# EAGLE design bop_pcb (EAGLE 9.6.2)
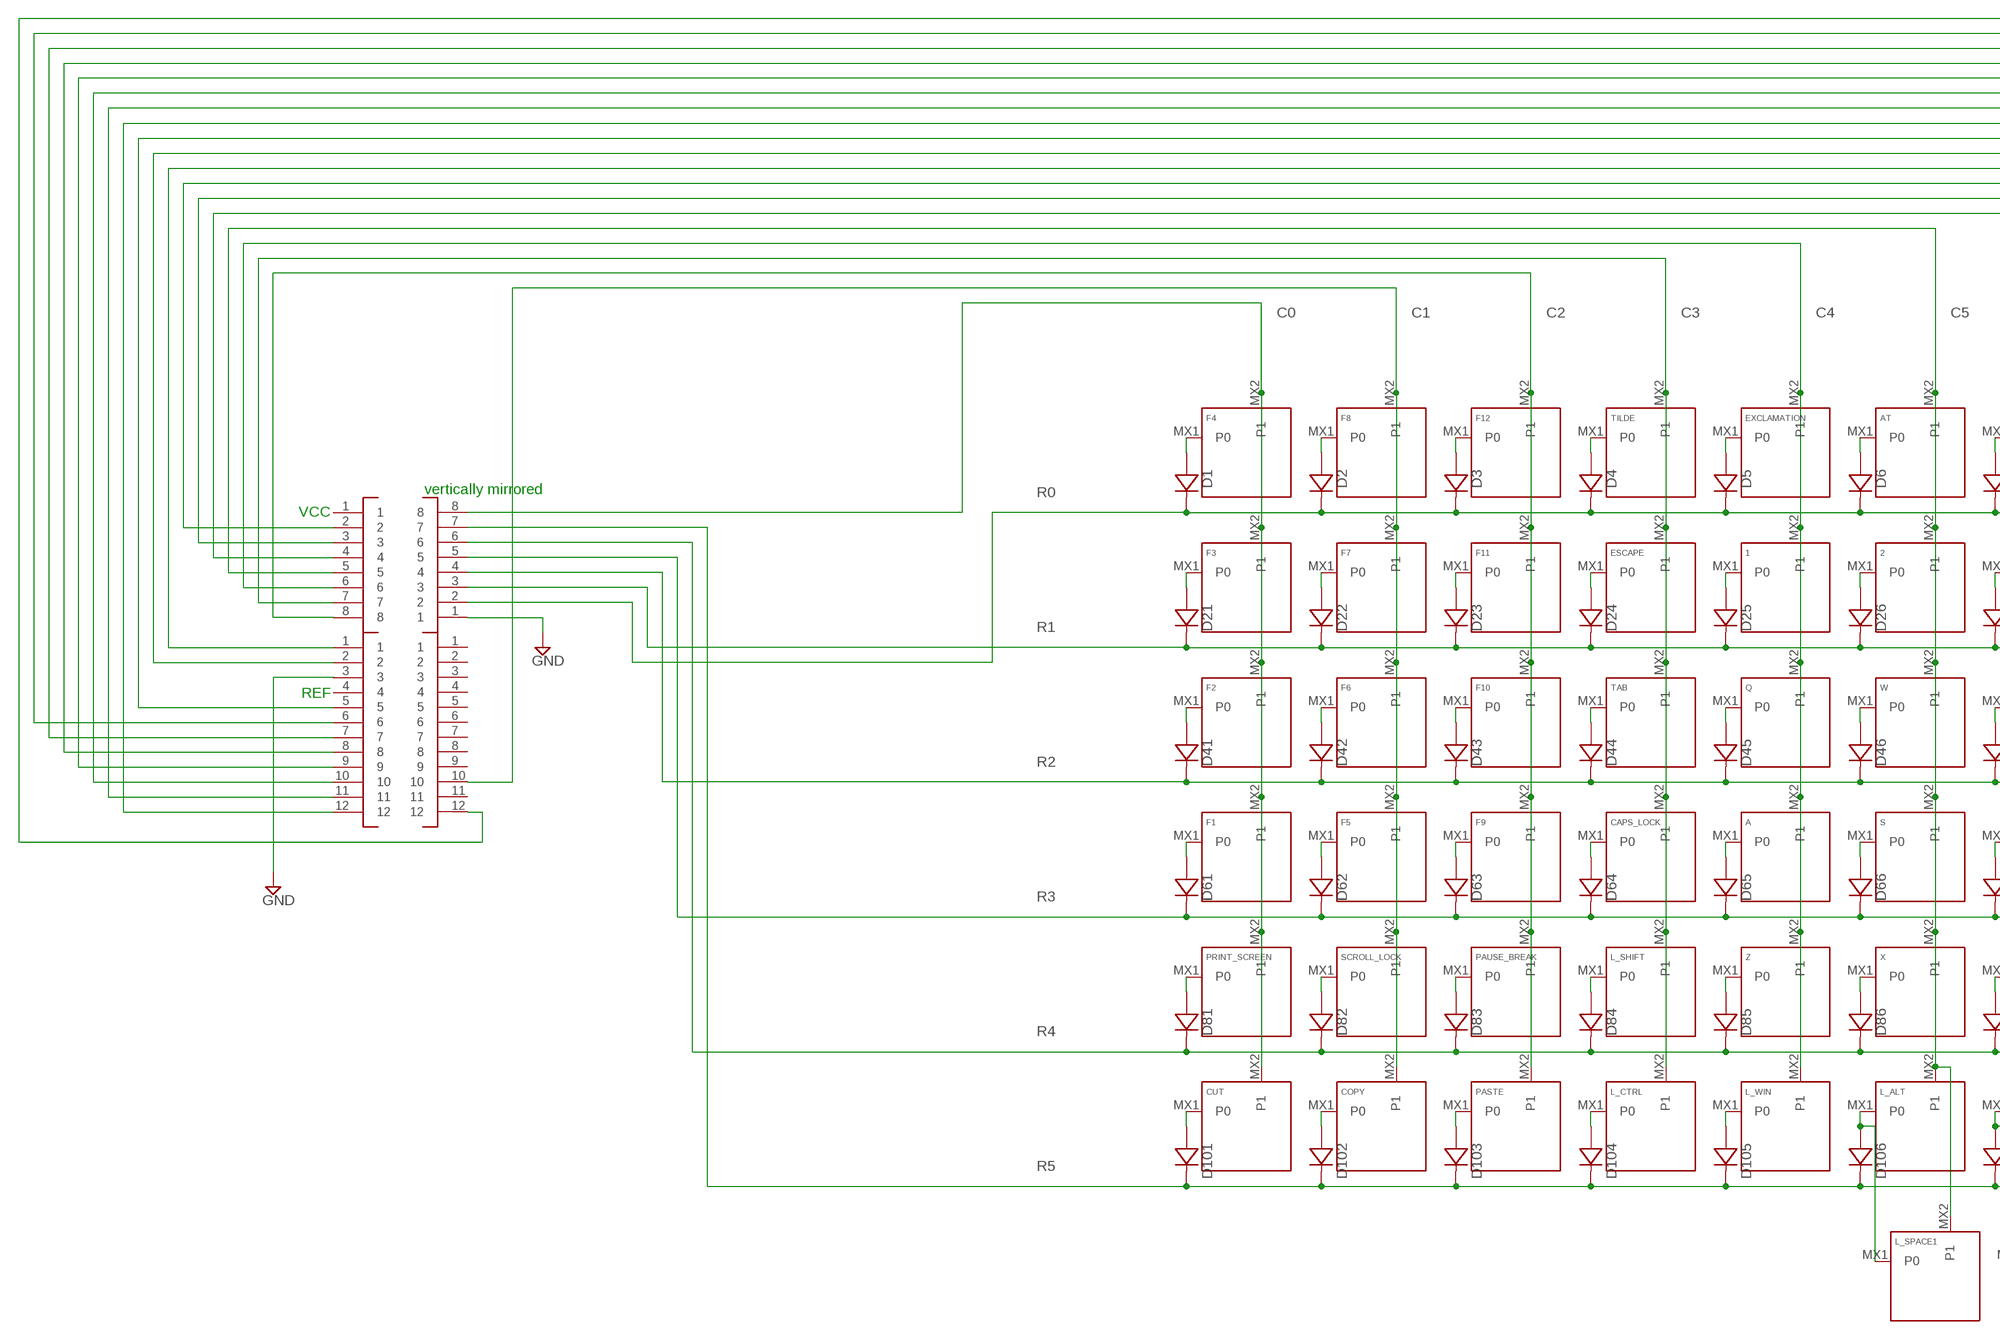
[diagram p0: schematic, sheet 1, part 1 of 2]
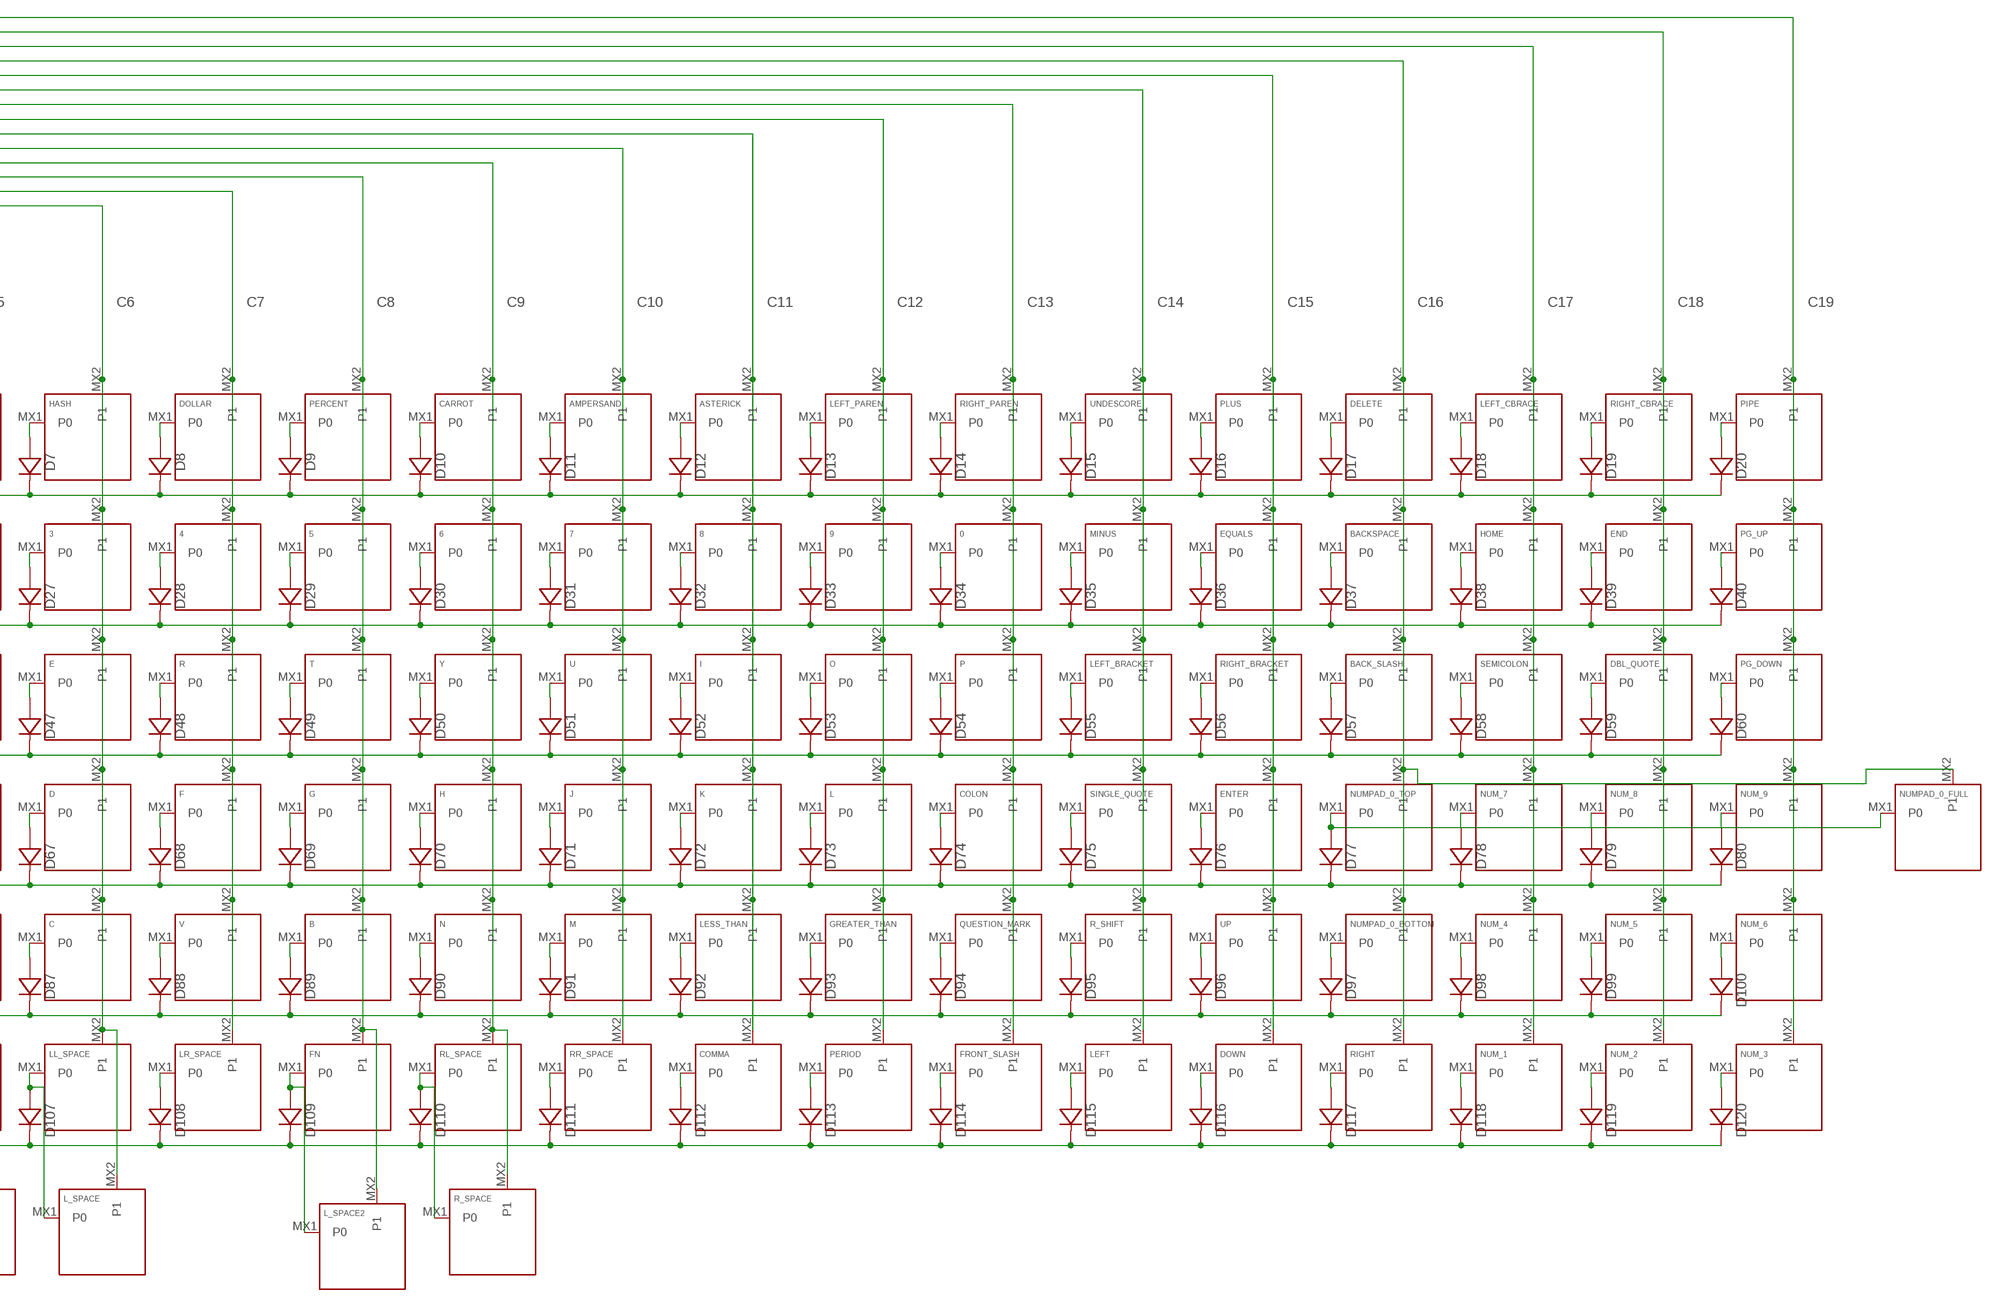
[diagram p1: schematic, sheet 1, part 2 of 2]

## Parts
0  KEYSWITCH-PLAIN-MX-1U  [MX-1U]
1  KEYSWITCH-PLAIN-MX-1U  [MX-1U]
2  KEYSWITCH-PLAIN-MX-1U  [MX-1U]
3  KEYSWITCH-PLAIN-MX-1U  [MX-1U]
4  KEYSWITCH-PLAIN-MX-1U  [MX-1U]
5  KEYSWITCH-PLAIN-MX-1U  [MX-1U]
6  KEYSWITCH-PLAIN-MX-1U  [MX-1U]
7  KEYSWITCH-PLAIN-MX-1U  [MX-1U]
8  KEYSWITCH-PLAIN-MX-1U  [MX-1U]
9  KEYSWITCH-PLAIN-MX-1U  [MX-1U]
A  KEYSWITCH-PLAIN-MX-1U  [MX-1U]
AMPERSAND  KEYSWITCH-PLAIN-MX-1U  [MX-1U]
ASTERICK  KEYSWITCH-PLAIN-MX-1U  [MX-1U]
AT  KEYSWITCH-PLAIN-MX-1U  [MX-1U]
B  KEYSWITCH-PLAIN-MX-1U  [MX-1U]
BACK_SLASH  KEYSWITCH-PLAIN-MX-1U  [MX-1U]
BACKSPACE  KEYSWITCH-PLAIN-MX-1U  [MX-1U]
C  KEYSWITCH-PLAIN-MX-1U  [MX-1U]
CAPS_LOCK  KEYSWITCH-PLAIN-MX-1U  [MX-1U]
CARROT  KEYSWITCH-PLAIN-MX-1U  [MX-1U]
COLON  KEYSWITCH-PLAIN-MX-1U  [MX-1U]
COMMA  KEYSWITCH-PLAIN-MX-1U  [MX-1U]
COPY  KEYSWITCH-PLAIN-MX-1U  [MX-1U]
CUT  KEYSWITCH-PLAIN-MX-1U  [MX-1U]
D  KEYSWITCH-PLAIN-MX-1U  [MX-1U]
D1  DIODE-SOD-123  [SOD-123]
D2  DIODE-SOD-123  [SOD-123]
D3  DIODE-SOD-123  [SOD-123]
D4  DIODE-SOD-123  [SOD-123]
D5  DIODE-SOD-123  [SOD-123]
D6  DIODE-SOD-123  [SOD-123]
D7  DIODE-SOD-123  [SOD-123]
D8  DIODE-SOD-123  [SOD-123]
D9  DIODE-SOD-123  [SOD-123]
D10  DIODE-SOD-123  [SOD-123]
D11  DIODE-SOD-123  [SOD-123]
D12  DIODE-SOD-123  [SOD-123]
D13  DIODE-SOD-123  [SOD-123]
D14  DIODE-SOD-123  [SOD-123]
D15  DIODE-SOD-123  [SOD-123]
D16  DIODE-SOD-123  [SOD-123]
D17  DIODE-SOD-123  [SOD-123]
D18  DIODE-SOD-123  [SOD-123]
D19  DIODE-SOD-123  [SOD-123]
D20  DIODE-SOD-123  [SOD-123]
D21  DIODE-SOD-123  [SOD-123]
D22  DIODE-SOD-123  [SOD-123]
D23  DIODE-SOD-123  [SOD-123]
D24  DIODE-SOD-123  [SOD-123]
D25  DIODE-SOD-123  [SOD-123]
D26  DIODE-SOD-123  [SOD-123]
D27  DIODE-SOD-123  [SOD-123]
D28  DIODE-SOD-123  [SOD-123]
D29  DIODE-SOD-123  [SOD-123]
D30  DIODE-SOD-123  [SOD-123]
D31  DIODE-SOD-123  [SOD-123]
D32  DIODE-SOD-123  [SOD-123]
D33  DIODE-SOD-123  [SOD-123]
D34  DIODE-SOD-123  [SOD-123]
D35  DIODE-SOD-123  [SOD-123]
D36  DIODE-SOD-123  [SOD-123]
D37  DIODE-SOD-123  [SOD-123]
D38  DIODE-SOD-123  [SOD-123]
D39  DIODE-SOD-123  [SOD-123]
D40  DIODE-SOD-123  [SOD-123]
D41  DIODE-SOD-123  [SOD-123]
D42  DIODE-SOD-123  [SOD-123]
D43  DIODE-SOD-123  [SOD-123]
D44  DIODE-SOD-123  [SOD-123]
D45  DIODE-SOD-123  [SOD-123]
D46  DIODE-SOD-123  [SOD-123]
D47  DIODE-SOD-123  [SOD-123]
D48  DIODE-SOD-123  [SOD-123]
D49  DIODE-SOD-123  [SOD-123]
D50  DIODE-SOD-123  [SOD-123]
D51  DIODE-SOD-123  [SOD-123]
D52  DIODE-SOD-123  [SOD-123]
D53  DIODE-SOD-123  [SOD-123]
D54  DIODE-SOD-123  [SOD-123]
D55  DIODE-SOD-123  [SOD-123]
D56  DIODE-SOD-123  [SOD-123]
D57  DIODE-SOD-123  [SOD-123]
D58  DIODE-SOD-123  [SOD-123]
D59  DIODE-SOD-123  [SOD-123]
D60  DIODE-SOD-123  [SOD-123]
D61  DIODE-SOD-123  [SOD-123]
D62  DIODE-SOD-123  [SOD-123]
D63  DIODE-SOD-123  [SOD-123]
D64  DIODE-SOD-123  [SOD-123]
D65  DIODE-SOD-123  [SOD-123]
D66  DIODE-SOD-123  [SOD-123]
D67  DIODE-SOD-123  [SOD-123]
D68  DIODE-SOD-123  [SOD-123]
D69  DIODE-SOD-123  [SOD-123]
D70  DIODE-SOD-123  [SOD-123]
D71  DIODE-SOD-123  [SOD-123]
D72  DIODE-SOD-123  [SOD-123]
D73  DIODE-SOD-123  [SOD-123]
D74  DIODE-SOD-123  [SOD-123]
D75  DIODE-SOD-123  [SOD-123]
D76  DIODE-SOD-123  [SOD-123]
D77  DIODE-SOD-123  [SOD-123]
D78  DIODE-SOD-123  [SOD-123]
D79  DIODE-SOD-123  [SOD-123]
D80  DIODE-SOD-123  [SOD-123]
D81  DIODE-SOD-123  [SOD-123]
D82  DIODE-SOD-123  [SOD-123]
D83  DIODE-SOD-123  [SOD-123]
D84  DIODE-SOD-123  [SOD-123]
D85  DIODE-SOD-123  [SOD-123]
D86  DIODE-SOD-123  [SOD-123]
D87  DIODE-SOD-123  [SOD-123]
D88  DIODE-SOD-123  [SOD-123]
D89  DIODE-SOD-123  [SOD-123]
D90  DIODE-SOD-123  [SOD-123]
D91  DIODE-SOD-123  [SOD-123]
D92  DIODE-SOD-123  [SOD-123]
D93  DIODE-SOD-123  [SOD-123]
D94  DIODE-SOD-123  [SOD-123]
D95  DIODE-SOD-123  [SOD-123]
D96  DIODE-SOD-123  [SOD-123]
D97  DIODE-SOD-123  [SOD-123]
D98  DIODE-SOD-123  [SOD-123]
D99  DIODE-SOD-123  [SOD-123]
D100  DIODE-SOD-123  [SOD-123]
D101  DIODE-SOD-123  [SOD-123]
D102  DIODE-SOD-123  [SOD-123]
D103  DIODE-SOD-123  [SOD-123]
D104  DIODE-SOD-123  [SOD-123]
D105  DIODE-SOD-123  [SOD-123]
D106  DIODE-SOD-123  [SOD-123]
D107  DIODE-SOD-123  [SOD-123]
D108  DIODE-SOD-123  [SOD-123]
D109  DIODE-SOD-123  [SOD-123]
D110  DIODE-SOD-123  [SOD-123]
D111  DIODE-SOD-123  [SOD-123]
D112  DIODE-SOD-123  [SOD-123]
D113  DIODE-SOD-123  [SOD-123]
D114  DIODE-SOD-123  [SOD-123]
D115  DIODE-SOD-123  [SOD-123]
D116  DIODE-SOD-123  [SOD-123]
D117  DIODE-SOD-123  [SOD-123]
D118  DIODE-SOD-123  [SOD-123]
D119  DIODE-SOD-123  [SOD-123]
D120  DIODE-SOD-123  [SOD-123]
DBL_QUOTE  KEYSWITCH-PLAIN-MX-1U  [MX-1U]
DELETE  KEYSWITCH-PLAIN-MX-1U  [MX-1U]
DOLLAR  KEYSWITCH-PLAIN-MX-1U  [MX-1U]
DOWN  KEYSWITCH-PLAIN-MX-1U  [MX-1U]
E  KEYSWITCH-PLAIN-MX-1U  [MX-1U]
END  KEYSWITCH-PLAIN-MX-1U  [MX-1U]
ENTER  KEYSWITCH-PLAIN-MX-1U  [MX-1U]
EQUALS  KEYSWITCH-PLAIN-MX-1U  [MX-1U]
ESCAPE  KEYSWITCH-PLAIN-MX-1U  [MX-1U]
EXCLAMATION  KEYSWITCH-PLAIN-MX-1U  [MX-1U]
F  KEYSWITCH-PLAIN-MX-1U  [MX-1U]
F1  KEYSWITCH-PLAIN-MX-1U  [MX-1U]
F2  KEYSWITCH-PLAIN-MX-1U  [MX-1U]
F3  KEYSWITCH-PLAIN-MX-1U  [MX-1U]
F4  KEYSWITCH-PLAIN-MX-1U  [MX-1U]
F5  KEYSWITCH-PLAIN-MX-1U  [MX-1U]
F6  KEYSWITCH-PLAIN-MX-1U  [MX-1U]
F7  KEYSWITCH-PLAIN-MX-1U  [MX-1U]
F8  KEYSWITCH-PLAIN-MX-1U  [MX-1U]
F9  KEYSWITCH-PLAIN-MX-1U  [MX-1U]
F10  KEYSWITCH-PLAIN-MX-1U  [MX-1U]
F11  KEYSWITCH-PLAIN-MX-1U  [MX-1U]
F12  KEYSWITCH-PLAIN-MX-1U  [MX-1U]
FN  KEYSWITCH-PLAIN-MX-1U  [MX-1U]
FRONT_SLASH  KEYSWITCH-PLAIN-MX-1U  [MX-1U]
G  KEYSWITCH-PLAIN-MX-1U  [MX-1U]
GREATER_THAN  KEYSWITCH-PLAIN-MX-1U  [MX-1U]
H  KEYSWITCH-PLAIN-MX-1U  [MX-1U]
HASH  KEYSWITCH-PLAIN-MX-1U  [MX-1U]
HOME  KEYSWITCH-PLAIN-MX-1U  [MX-1U]
I  KEYSWITCH-PLAIN-MX-1U  [MX-1U]
J  KEYSWITCH-PLAIN-MX-1U  [MX-1U]
J1  HEADER-12X1-2.54-ROUND  [HEADER-12X1-2.54-ROUND]
J2  HEADER-12X1-2.54-ROUND  [HEADER-12X1-2.54-ROUND]
K  KEYSWITCH-PLAIN-MX-1U  [MX-1U]
L  KEYSWITCH-PLAIN-MX-1U  [MX-1U]
L_ALT  KEYSWITCH-PLAIN-MX-1U  [MX-1U]
L_CTRL  KEYSWITCH-PLAIN-MX-1U  [MX-1U]
L_SHIFT  KEYSWITCH-PLAIN-MX-1U  [MX-1U]
L_SPACE  KEYSWITCH-PLAIN-MX-2U  [MX-2U]
L_SPACE1  KEYSWITCH-PLAIN-MX-2U  [MX-2U]
L_SPACE2  KEYSWITCH-PLAIN-MX-2U  [MX-2U]
L_WIN  KEYSWITCH-PLAIN-MX-1U  [MX-1U]
LEFT  KEYSWITCH-PLAIN-MX-1U  [MX-1U]
LEFT_BRACKET  KEYSWITCH-PLAIN-MX-1U  [MX-1U]
LEFT_CBRACE  KEYSWITCH-PLAIN-MX-1U  [MX-1U]
LEFT_PAREN  KEYSWITCH-PLAIN-MX-1U  [MX-1U]
LESS_THAN  KEYSWITCH-PLAIN-MX-1U  [MX-1U]
LL_SPACE  KEYSWITCH-PLAIN-MX-1U  [MX-1U]
LR_SPACE  KEYSWITCH-PLAIN-MX-1U  [MX-1U]
M  KEYSWITCH-PLAIN-MX-1U  [MX-1U]
MINUS  KEYSWITCH-PLAIN-MX-1U  [MX-1U]
N  KEYSWITCH-PLAIN-MX-1U  [MX-1U]
NUM_1  KEYSWITCH-PLAIN-MX-1U  [MX-1U]
NUM_2  KEYSWITCH-PLAIN-MX-1U  [MX-1U]
NUM_3  KEYSWITCH-PLAIN-MX-1U  [MX-1U]
NUM_4  KEYSWITCH-PLAIN-MX-1U  [MX-1U]
NUM_5  KEYSWITCH-PLAIN-MX-1U  [MX-1U]
NUM_6  KEYSWITCH-PLAIN-MX-1U  [MX-1U]
NUM_7  KEYSWITCH-PLAIN-MX-1U  [MX-1U]
NUM_8  KEYSWITCH-PLAIN-MX-1U  [MX-1U]
NUM_9  KEYSWITCH-PLAIN-MX-1U  [MX-1U]
NUMPAD_0_BOTTOM  KEYSWITCH-PLAIN-MX-1U  [MX-1U]
NUMPAD_0_FULL  KEYSWITCH-PLAIN-MX-2U  [MX-2U]
NUMPAD_0_TOP  KEYSWITCH-PLAIN-MX-1U  [MX-1U]
O  KEYSWITCH-PLAIN-MX-1U  [MX-1U]
P  KEYSWITCH-PLAIN-MX-1U  [MX-1U]
PASTE  KEYSWITCH-PLAIN-MX-1U  [MX-1U]
PAUSE_BREAK  KEYSWITCH-PLAIN-MX-1U  [MX-1U]
PERCENT  KEYSWITCH-PLAIN-MX-1U  [MX-1U]
PERIOD  KEYSWITCH-PLAIN-MX-1U  [MX-1U]
PG_DOWN  KEYSWITCH-PLAIN-MX-1U  [MX-1U]
PG_UP  KEYSWITCH-PLAIN-MX-1U  [MX-1U]
PIPE  KEYSWITCH-PLAIN-MX-1U  [MX-1U]
PLUS  KEYSWITCH-PLAIN-MX-1U  [MX-1U]
PRINT_SCREEN  KEYSWITCH-PLAIN-MX-1U  [MX-1U]
Q  KEYSWITCH-PLAIN-MX-1U  [MX-1U]
QUESTION_MARK  KEYSWITCH-PLAIN-MX-1U  [MX-1U]
R  KEYSWITCH-PLAIN-MX-1U  [MX-1U]
R_SHIFT  KEYSWITCH-PLAIN-MX-1U  [MX-1U]
R_SPACE  KEYSWITCH-PLAIN-MX-2U  [MX-2U]
RIGHT  KEYSWITCH-PLAIN-MX-1U  [MX-1U]
RIGHT_BRACKET  KEYSWITCH-PLAIN-MX-1U  [MX-1U]
RIGHT_CBRACE  KEYSWITCH-PLAIN-MX-1U  [MX-1U]
RIGHT_PAREN  KEYSWITCH-PLAIN-MX-1U  [MX-1U]
RL_SPACE  KEYSWITCH-PLAIN-MX-1U  [MX-1U]
RR_SPACE  KEYSWITCH-PLAIN-MX-1U  [MX-1U]
S  KEYSWITCH-PLAIN-MX-1U  [MX-1U]
SCROLL_LOCK  KEYSWITCH-PLAIN-MX-1U  [MX-1U]
SEMICOLON  KEYSWITCH-PLAIN-MX-1U  [MX-1U]
SINGLE_QUOTE  KEYSWITCH-PLAIN-MX-1U  [MX-1U]
T  KEYSWITCH-PLAIN-MX-1U  [MX-1U]
TAB  KEYSWITCH-PLAIN-MX-1U  [MX-1U]
TILDE  KEYSWITCH-PLAIN-MX-1U  [MX-1U]
U  KEYSWITCH-PLAIN-MX-1U  [MX-1U]
U$1  HEADER-8X1-2.54  [HEADER-8X1-2.54]
U$2  HEADER-8X1-2.54  [HEADER-8X1-2.54]
UNDESCORE  KEYSWITCH-PLAIN-MX-1U  [MX-1U]
UP  KEYSWITCH-PLAIN-MX-1U  [MX-1U]
V  KEYSWITCH-PLAIN-MX-1U  [MX-1U]
W  KEYSWITCH-PLAIN-MX-1U  [MX-1U]
X  KEYSWITCH-PLAIN-MX-1U  [MX-1U]
Y  KEYSWITCH-PLAIN-MX-1U  [MX-1U]
Z  KEYSWITCH-PLAIN-MX-1U  [MX-1U]

## Nets
C0: CUT.MX2(P1) F1.MX2(P1) F2.MX2(P1) F3.MX2(P1) F4.MX2(P1) PRINT_SCREEN.MX2(P1) U$2.8
C1: COPY.MX2(P1) F5.MX2(P1) F6.MX2(P1) F7.MX2(P1) F8.MX2(P1) J1.10 SCROLL_LOCK.MX2(P1)
C2: F9.MX2(P1) F10.MX2(P1) F11.MX2(P1) F12.MX2(P1) PASTE.MX2(P1) PAUSE_BREAK.MX2(P1) U$1.8
C3: CAPS_LOCK.MX2(P1) ESCAPE.MX2(P1) L_CTRL.MX2(P1) L_SHIFT.MX2(P1) TAB.MX2(P1) TILDE.MX2(P1) U$1.7
C4: 1.MX2(P1) A.MX2(P1) EXCLAMATION.MX2(P1) L_WIN.MX2(P1) Q.MX2(P1) U$1.6 Z.MX2(P1)
C5: 2.MX2(P1) AT.MX2(P1) L_ALT.MX2(P1) L_SPACE1.MX2(P1) S.MX2(P1) U$1.5 W.MX2(P1) X.MX2(P1)
C6: 3.MX2(P1) C.MX2(P1) D.MX2(P1) E.MX2(P1) HASH.MX2(P1) L_SPACE.MX2(P1) LL_SPACE.MX2(P1) U$1.4
C7: 4.MX2(P1) DOLLAR.MX2(P1) F.MX2(P1) LR_SPACE.MX2(P1) R.MX2(P1) U$1.3 V.MX2(P1)
C8: 5.MX2(P1) B.MX2(P1) FN.MX2(P1) G.MX2(P1) L_SPACE2.MX2(P1) PERCENT.MX2(P1) T.MX2(P1) U$1.2
C9: 6.MX2(P1) CARROT.MX2(P1) H.MX2(P1) J2.1 N.MX2(P1) R_SPACE.MX2(P1) RL_SPACE.MX2(P1) Y.MX2(P1)
C10: 7.MX2(P1) AMPERSAND.MX2(P1) J2.2 J.MX2(P1) M.MX2(P1) RR_SPACE.MX2(P1) U.MX2(P1)
C11: 8.MX2(P1) ASTERICK.MX2(P1) COMMA.MX2(P1) I.MX2(P1) J2.5 K.MX2(P1) LESS_THAN.MX2(P1)
C12: 9.MX2(P1) GREATER_THAN.MX2(P1) J2.12 L.MX2(P1) LEFT_PAREN.MX2(P1) O.MX2(P1) PERIOD.MX2(P1)
C13: 0.MX2(P1) COLON.MX2(P1) FRONT_SLASH.MX2(P1) J2.11 P.MX2(P1) QUESTION_MARK.MX2(P1) RIGHT_PAREN.MX2(P1)
C14: J2.10 LEFT.MX2(P1) LEFT_BRACKET.MX2(P1) MINUS.MX2(P1) R_SHIFT.MX2(P1) SINGLE_QUOTE.MX2(P1) UNDESCORE.MX2(P1)
C15: DOWN.MX2(P1) ENTER.MX2(P1) EQUALS.MX2(P1) J2.9 PLUS.MX2(P1) RIGHT_BRACKET.MX2(P1) UP.MX2(P1)
C16: BACK_SLASH.MX2(P1) BACKSPACE.MX2(P1) DELETE.MX2(P1) J2.8 NUMPAD_0_BOTTOM.MX2(P1) NUMPAD_0_FULL.MX2(P1) NUMPAD_0_TOP.MX2(P1) RIGHT.MX2(P1)
C17: HOME.MX2(P1) J2.7 LEFT_CBRACE.MX2(P1) NUM_1.MX2(P1) NUM_4.MX2(P1) NUM_7.MX2(P1) SEMICOLON.MX2(P1)
C18: DBL_QUOTE.MX2(P1) END.MX2(P1) J2.6 NUM_2.MX2(P1) NUM_5.MX2(P1) NUM_8.MX2(P1) RIGHT_CBRACE.MX2(P1)
C19: J1.12 NUM_3.MX2(P1) NUM_6.MX2(P1) NUM_9.MX2(P1) PG_DOWN.MX2(P1) PG_UP.MX2(P1) PIPE.MX2(P1)
GND: J2.3 U$2.1
N$1: D1.A F4.MX1(P0)
N$2: D2.A F8.MX1(P0)
N$3: D3.A F12.MX1(P0)
N$4: D4.A TILDE.MX1(P0)
N$5: D5.A EXCLAMATION.MX1(P0)
N$6: AT.MX1(P0) D6.A
N$7: D7.A HASH.MX1(P0)
N$8: D8.A DOLLAR.MX1(P0)
N$9: D9.A PERCENT.MX1(P0)
N$10: CARROT.MX1(P0) D10.A
N$11: AMPERSAND.MX1(P0) D11.A
N$12: ASTERICK.MX1(P0) D12.A
N$13: D13.A LEFT_PAREN.MX1(P0)
N$14: D14.A RIGHT_PAREN.MX1(P0)
N$15: D15.A UNDESCORE.MX1(P0)
N$16: D16.A PLUS.MX1(P0)
N$17: D17.A DELETE.MX1(P0)
N$18: D18.A LEFT_CBRACE.MX1(P0)
N$19: D19.A RIGHT_CBRACE.MX1(P0)
N$20: D20.A PIPE.MX1(P0)
N$21: D21.A F3.MX1(P0)
N$22: D22.A F7.MX1(P0)
N$23: D23.A F11.MX1(P0)
N$24: D24.A ESCAPE.MX1(P0)
N$25: 1.MX1(P0) D25.A
N$26: 2.MX1(P0) D26.A
N$27: 3.MX1(P0) D27.A
N$28: 4.MX1(P0) D28.A
N$29: 5.MX1(P0) D29.A
N$30: 6.MX1(P0) D30.A
N$31: 7.MX1(P0) D31.A
N$32: 8.MX1(P0) D32.A
N$33: 9.MX1(P0) D33.A
N$34: 0.MX1(P0) D34.A
N$35: D35.A MINUS.MX1(P0)
N$36: D36.A EQUALS.MX1(P0)
N$37: BACKSPACE.MX1(P0) D37.A
N$38: D38.A HOME.MX1(P0)
N$39: D39.A END.MX1(P0)
N$40: D40.A PG_UP.MX1(P0)
N$41: D41.A F2.MX1(P0)
N$42: D42.A F6.MX1(P0)
N$43: D43.A F10.MX1(P0)
N$44: D44.A TAB.MX1(P0)
N$45: D45.A Q.MX1(P0)
N$46: D46.A W.MX1(P0)
N$47: D47.A E.MX1(P0)
N$48: D48.A R.MX1(P0)
N$49: D49.A T.MX1(P0)
N$50: D50.A Y.MX1(P0)
N$51: D51.A U.MX1(P0)
N$52: D52.A I.MX1(P0)
N$53: D53.A O.MX1(P0)
N$54: D54.A P.MX1(P0)
N$55: D55.A LEFT_BRACKET.MX1(P0)
N$56: D56.A RIGHT_BRACKET.MX1(P0)
N$57: BACK_SLASH.MX1(P0) D57.A
N$58: D58.A SEMICOLON.MX1(P0)
N$59: D59.A DBL_QUOTE.MX1(P0)
N$60: D60.A PG_DOWN.MX1(P0)
N$61: D61.A F1.MX1(P0)
N$62: D62.A F5.MX1(P0)
N$63: D63.A F9.MX1(P0)
N$64: CAPS_LOCK.MX1(P0) D64.A
N$65: A.MX1(P0) D65.A
N$66: D66.A S.MX1(P0)
N$67: D67.A D.MX1(P0)
N$68: D68.A F.MX1(P0)
N$69: D69.A G.MX1(P0)
N$70: D70.A H.MX1(P0)
N$71: D71.A J.MX1(P0)
N$72: D72.A K.MX1(P0)
N$73: D73.A L.MX1(P0)
N$74: COLON.MX1(P0) D74.A
N$75: D75.A SINGLE_QUOTE.MX1(P0)
N$76: D76.A ENTER.MX1(P0)
N$77: D77.A NUMPAD_0_FULL.MX1(P0) NUMPAD_0_TOP.MX1(P0)
N$79: D79.A NUM_8.MX1(P0)
N$80: D80.A NUM_9.MX1(P0)
N$81: D81.A PRINT_SCREEN.MX1(P0)
N$82: D82.A SCROLL_LOCK.MX1(P0)
N$83: D83.A PAUSE_BREAK.MX1(P0)
N$84: D84.A L_SHIFT.MX1(P0)
N$85: D85.A Z.MX1(P0)
N$86: D86.A X.MX1(P0)
N$87: C.MX1(P0) D87.A
N$88: D88.A V.MX1(P0)
N$89: B.MX1(P0) D89.A
N$90: D90.A N.MX1(P0)
N$91: D91.A M.MX1(P0)
N$92: D92.A LESS_THAN.MX1(P0)
N$93: D93.A GREATER_THAN.MX1(P0)
N$94: D94.A QUESTION_MARK.MX1(P0)
N$95: D95.A R_SHIFT.MX1(P0)
N$96: D96.A UP.MX1(P0)
N$97: D97.A NUMPAD_0_BOTTOM.MX1(P0)
N$98: D98.A NUM_4.MX1(P0)
N$99: D99.A NUM_5.MX1(P0)
N$100: D100.A NUM_6.MX1(P0)
N$101: CUT.MX1(P0) D101.A
N$102: COPY.MX1(P0) D102.A
N$103: D103.A PASTE.MX1(P0)
N$104: D104.A L_CTRL.MX1(P0)
N$105: D105.A L_WIN.MX1(P0)
N$106: D106.A L_ALT.MX1(P0) L_SPACE1.MX1(P0)
N$107: D107.A L_SPACE.MX1(P0) LL_SPACE.MX1(P0)
N$108: D108.A LR_SPACE.MX1(P0)
N$109: D109.A FN.MX1(P0) L_SPACE2.MX1(P0)
N$110: D110.A R_SPACE.MX1(P0) RL_SPACE.MX1(P0)
N$111: D111.A RR_SPACE.MX1(P0)
N$112: COMMA.MX1(P0) D112.A
N$113: D113.A PERIOD.MX1(P0)
N$114: D114.A FRONT_SLASH.MX1(P0)
N$115: D115.A LEFT.MX1(P0)
N$116: D116.A DOWN.MX1(P0)
N$117: D117.A RIGHT.MX1(P0)
N$118: D118.A NUM_1.MX1(P0)
N$119: D119.A NUM_2.MX1(P0)
N$120: D120.A NUM_3.MX1(P0)
N$121: D78.A NUM_7.MX1(P0)
R0: D1.C D2.C D3.C D4.C D5.C D6.C D7.C D8.C D9.C D10.C D11.C D12.C D13.C D14.C D15.C D16.C D17.C D18.C D19.C D20.C U$2.2
R1: D21.C D22.C D23.C D24.C D25.C D26.C D27.C D28.C D29.C D30.C D31.C D32.C D33.C D34.C D35.C D36.C D37.C D38.C D39.C D40.C U$2.3
R2: D41.C D42.C D43.C D44.C D45.C D46.C D47.C D48.C D49.C D50.C D51.C D52.C D53.C D54.C D55.C D56.C D57.C D58.C D59.C D60.C U$2.4
R3: D61.C D62.C D63.C D64.C D65.C D66.C D67.C D68.C D69.C D70.C D71.C D72.C D73.C D74.C D75.C D76.C D77.C D78.C D79.C D80.C U$2.5
R4: D81.C D82.C D83.C D84.C D85.C D86.C D87.C D88.C D89.C D90.C D91.C D92.C D93.C D94.C D95.C D96.C D97.C D98.C D99.C D100.C U$2.6
R5: D101.C D102.C D103.C D104.C D105.C D106.C D107.C D108.C D109.C D110.C D111.C D112.C D113.C D114.C D115.C D116.C D117.C D118.C D119.C D120.C U$2.7
Unconnected: J1.1 J1.2 J1.3 J1.4 J1.5 J1.6 J1.7 J1.8 J1.9 J1.11 J2.4 U$1.1

## Notes on the sheet
- vertically mirrored
- VCC
- REF

## Library data of the parts
0 1-9 A AMPERSAND ASTERICK AT B BACK_SLASH BACKSPACE C CAPS_LOCK CARROT COLON COMMA COPY CUT D DBL_QUOTE DELETE DOLLAR DOWN E END ENTER EQUALS ESCAPE EXCLAMATION F F1-F12 FN FRONT_SLASH G GREATER_THAN H HASH HOME I J K L L_ALT L_CTRL L_SHIFT L_SPACE L_SPACE1 L_SPACE2 L_WIN LEFT LEFT_BRACKET LEFT_CBRACE LEFT_PAREN LESS_THAN LL_SPACE LR_SPACE M MINUS N NUM_1-NUM_9 NUMPAD_0_BOTTOM NUMPAD_0_FULL NUMPAD_0_TOP O P PASTE PAUSE_BREAK PERCENT PERIOD PG_DOWN PG_UP PIPE PLUS PRINT_SCREEN Q QUESTION_MARK R R_SHIFT R_SPACE RIGHT RIGHT_BRACKET RIGHT_CBRACE RIGHT_PAREN RL_SPACE RR_SPACE S SCROLL_LOCK SEMICOLON SINGLE_QUOTE T TAB TILDE U UNDESCORE UP V W X Y Z = Keyboard:KEYSWITCH-PLAIN
D1-D120 = Components:DIODE: Standard 1N4148 diode
J1 J2 = Controller:HEADER-12X1
U$1 U$2 = Controller:HEADER-8X1

## Board
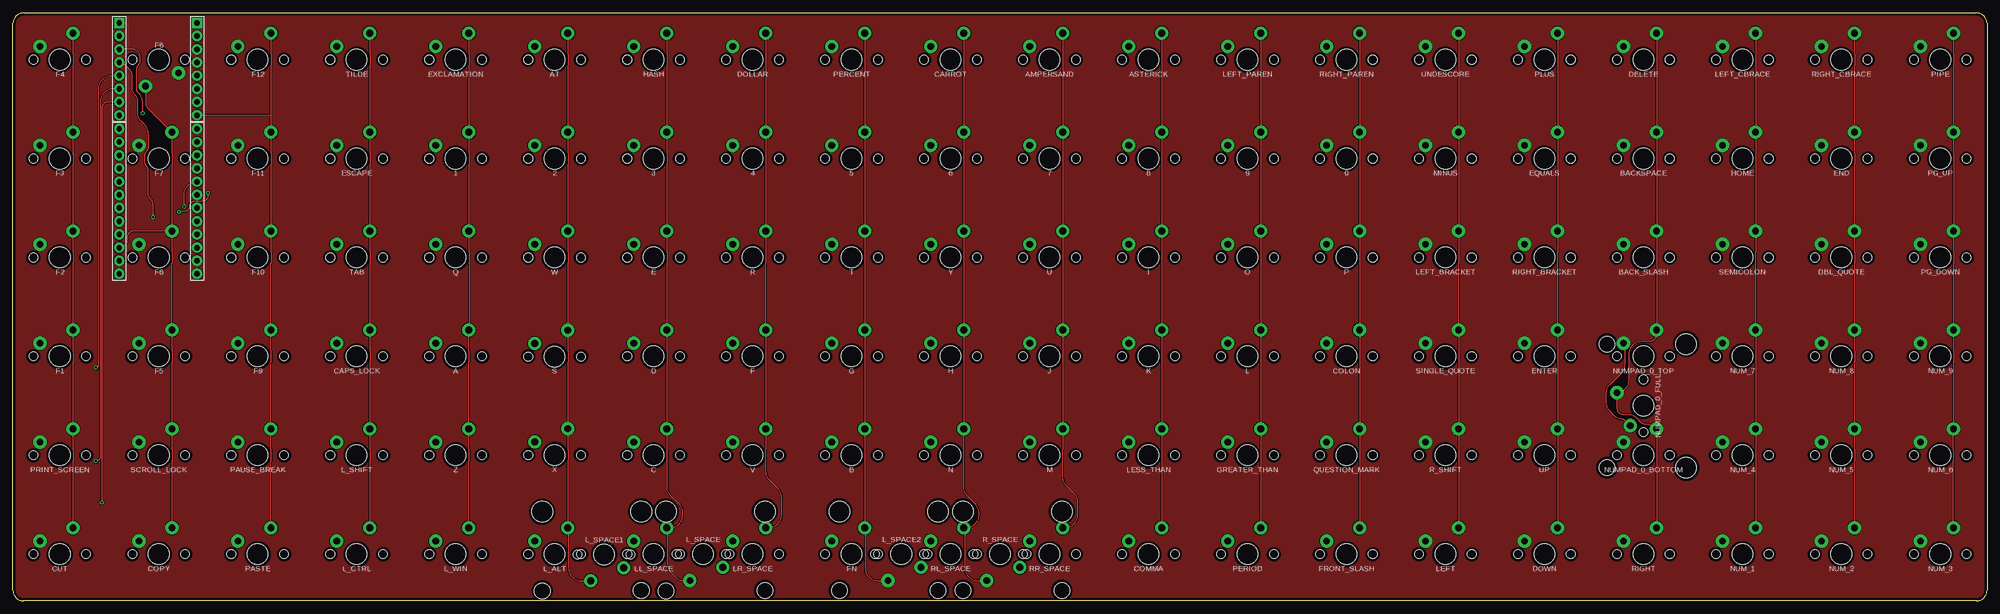
[diagram p2: board, top side]
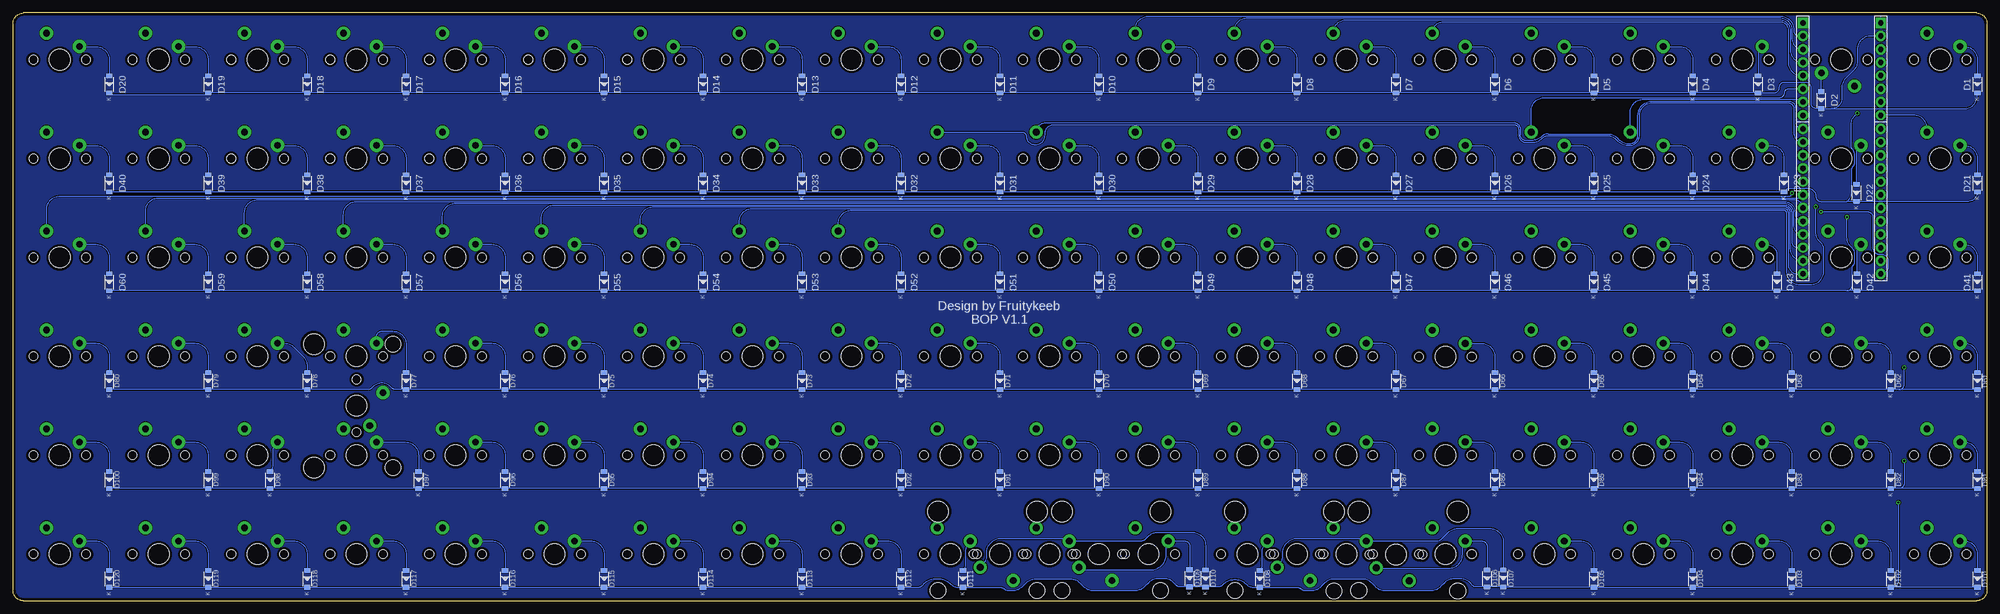
[diagram p3: board, bottom side, seen from below]

Size 379.95 x 113.25 mm. Coordinates in mm from the lower left corner, seen from the top.
Outline: 2,113.25 377.95,113.25 arc-90 379.95,111.25 379.95,2 arc-90 377.95,0 2,0 arc-90 0,2 0,111.25 arc-90 2,113.25
Copper layers (1*16): Top 0.035mm / dielectric 1.5mm / Bottom 0.035mm
Design rules "default *": minimum track width 6mil, minimum drill 0.35mm, track to track 6mil, track to pad 6mil, pad to pad 6mil, via to via 6mil, smd to smd 6mil, copper to edge 20mil, drill to drill 6mil, minimum pad ring 10mil, minimum via ring 8mil, stop-mask expansion 4mil, vias tented up to drill 0mil, thermal gap 10mil

### Footprints (pad centres in the part's own frame; a part is rotated, then mirrored left to right if it is on the bottom)
MX-1U = drill 1.3 pad 2.54: MX1 -3.81,2.54; MX2 2.54,5.08 | hole 4: 0,0 | hole 1.7: -5.08,0; 5.08,0
SOD-123 = smd 0.91 x 1.22: A -1.635,0; C 1.635,0
HEADER-12X1-2.54-ROUND = drill 1.05 pad 2: 1 -13.97,0; 2 -11.43,0; 3 -8.89,0; 4 -6.35,0; 5 -3.81,0; 6 -1.27,0; 7 1.27,0; 8 3.81,0; 9 6.35,0; 10 8.89,0; 11 11.43,0; 12 13.97,0
MX-2U = drill 1.3 pad 2.54: MX1 -3.81,2.54; MX2 2.54,5.08 | hole 4: 0,0; -11.9,-8.24; 11.9,-8.24 | hole 1.7: -5.08,0; 5.08,0 | hole 3.05: -11.9,7; 11.9,7
HEADER-8X1-2.54 = drill 1.05 pad 2 square: 1 -8.89,0 | drill 1.05 pad 2: 2 -6.35,0; 3 -3.81,0; 4 -1.27,0; 5 1.27,0; 6 3.81,0; 7 6.35,0; 8 8.89,0

### Placement (x,y rotation side)
0  256.65,85.2 0 top
1  85.2,85.2 0 top
2  104.25,85.2 0 top
3  123.3,85.2 0 top
4  142.35,85.2 0 top
5  161.4,85.2 0 top
6  180.45,85.2 0 top
7  199.5,85.2 0 top
8  218.55,85.2 0 top
9  237.6,85.2 0 top
A  85.2,47.1 0 top
AMPERSAND  199.5,104.25 0 top
ASTERICK  218.55,104.25 0 top
AT  104.25,104.25 0 top
B  161.4,28.05 0 top
BACK_SLASH  313.8,66.15 0 top
BACKSPACE  313.8,85.2 0 top
C  123.3,28.05 0 top
CAPS_LOCK  66.15,47.1 0 top
CARROT  180.45,104.25 0 top
COLON  256.65,47.1 0 top
COMMA  218.55,9 0 top
COPY  28.05,9 0 top
CUT  9,9 0 top
D  123.3,47.1 0 top
D1  1.86,99.49 270 bottom
D2  31.9,96.45 270 bottom
D3  44.08,99.49 270 bottom
D4  56.62,99.49 270 bottom
D5  75.67,99.49 270 bottom
D6  94.73,99.49 270 bottom
D7  113.78,99.49 270 bottom
D8  132.82,99.49 270 bottom
D9  151.88,99.49 270 bottom
D10  170.92,99.49 270 bottom
D11  189.97,99.49 270 bottom
D12  209.02,99.49 270 bottom
D13  228.07,99.49 270 bottom
D14  247.12,99.49 270 bottom
D15  266.18,99.49 270 bottom
D16  285.22,99.49 270 bottom
D17  304.27,99.49 270 bottom
D18  323.32,99.49 270 bottom
D19  342.38,99.49 270 bottom
D20  361.43,99.49 270 bottom
D21  1.86,80.44 270 bottom
D22  25.12,78.59 270 bottom
D23  39.08,80.44 270 bottom
D24  56.62,80.44 270 bottom
D25  75.67,80.44 270 bottom
D26  94.73,80.44 270 bottom
D27  113.78,80.44 270 bottom
D28  132.82,80.44 270 bottom
D29  151.88,80.44 270 bottom
D30  170.92,80.44 270 bottom
D31  189.97,80.44 270 bottom
D32  209.02,80.44 270 bottom
D33  228.07,80.44 270 bottom
D34  247.12,80.44 270 bottom
D35  266.18,80.44 270 bottom
D36  285.22,80.44 270 bottom
D37  304.27,80.44 270 bottom
D38  323.32,80.44 270 bottom
D39  342.38,80.44 270 bottom
D40  361.43,80.44 270 bottom
D41  1.86,61.39 270 bottom
D42  25.03,61.39 270 bottom
D43  40.44,61.39 270 bottom
D44  56.62,61.39 270 bottom
D45  75.67,61.39 270 bottom
D46  94.73,61.39 270 bottom
D47  113.78,61.39 270 bottom
D48  132.82,61.39 270 bottom
D49  151.88,61.39 270 bottom
D50  170.92,61.39 270 bottom
D51  189.97,61.39 270 bottom
D52  209.02,61.39 270 bottom
D53  228.07,61.39 270 bottom
D54  247.12,61.39 270 bottom
D55  266.18,61.39 270 bottom
D56  285.22,61.39 270 bottom
D57  304.27,61.39 270 bottom
D58  323.32,61.39 270 bottom
D59  342.38,61.39 270 bottom
D60  361.43,61.39 270 bottom
D61  1.86,42.34 270 bottom
D62  18.52,42.34 270 bottom
D63  37.58,42.34 270 bottom
D64  56.62,42.34 270 bottom
D65  75.67,42.34 270 bottom
D66  94.73,42.34 270 bottom
D67  113.78,42.34 270 bottom
D68  132.82,42.34 270 bottom
D69  151.88,42.34 270 bottom
D70  170.92,42.34 270 bottom
D71  189.97,42.34 270 bottom
D72  209.02,42.34 270 bottom
D73  228.07,42.34 270 bottom
D74  247.12,42.34 270 bottom
D75  266.18,42.34 270 bottom
D76  285.22,42.34 270 bottom
D77  304.27,42.34 270 bottom
D78  323.32,42.34 270 bottom
D79  342.38,42.34 270 bottom
D80  361.43,42.34 270 bottom
D81  1.86,23.29 270 bottom
D82  18.52,23.29 270 bottom
D83  37.58,23.29 270 bottom
D84  56.62,23.29 270 bottom
D85  75.67,23.29 270 bottom
D86  94.73,23.29 270 bottom
D87  113.78,23.29 270 bottom
D88  132.82,23.29 270 bottom
D89  151.88,23.29 270 bottom
D90  170.92,23.29 270 bottom
D91  189.97,23.29 270 bottom
D92  209.02,23.29 270 bottom
D93  228.07,23.29 270 bottom
D94  247.12,23.29 270 bottom
D95  266.18,23.29 270 bottom
D96  285.22,23.29 270 bottom
D97  301.89,23.29 270 bottom
D98  330.47,23.29 270 bottom
D99  342.38,23.29 270 bottom
D100  361.43,23.29 270 bottom
D101  1.86,4.24 270 bottom
D102  18.52,4.24 270 bottom
D103  37.58,4.24 270 bottom
D104  56.62,4.24 270 bottom
D105  75.67,4.24 270 bottom
D106  96.22,4.31 270 bottom
D107  93.12,4.31 270 bottom
D108  139.97,4.24 270 bottom
D109  153.48,4.34 270 bottom
D110  150.42,4.3 270 bottom
D111  197.12,4.24 270 bottom
D112  209.02,4.24 270 bottom
D113  228.07,4.24 270 bottom
D114  247.12,4.24 270 bottom
D115  266.18,4.24 270 bottom
D116  285.22,4.24 270 bottom
D117  304.27,4.24 270 bottom
D118  323.32,4.24 270 bottom
D119  342.38,4.24 270 bottom
D120  361.43,4.24 270 bottom
DBL_QUOTE  351.9,66.15 0 top
DELETE  313.8,104.25 0 top
DOLLAR  142.35,104.25 0 top
DOWN  294.75,9 0 top
E  123.3,66.15 0 top
END  351.9,85.2 0 top
ENTER  294.75,47.1 0 top
EQUALS  294.75,85.2 0 top
ESCAPE  66.15,85.2 0 top
EXCLAMATION  85.2,104.25 0 top
F  142.35,47.1 0 top
F1  9,47.1 0 top
F2  9,66.15 0 top
F3  9,85.2 0 top
F4  9,104.25 0 top
F5  28.05,47.1 0 top
F6  28.05,66.15 0 top
F7  28.05,85.2 0 top
F8  28.05,104.25 180 top
F9  47.1,47.1 0 top
F10  47.1,66.15 0 top
F11  47.1,85.2 0 top
F12  47.1,104.25 0 top
FN  161.4,9 0 top
FRONT_SLASH  256.65,9 0 top
G  161.4,47.1 0 top
GREATER_THAN  237.6,28.05 0 top
H  180.45,47.1 0 top
HASH  123.3,104.25 0 top
HOME  332.85,85.2 0 top
I  218.55,66.15 0 top
J  199.5,47.1 0 top
J1  20.45,76.95 270 top
J2  35.45,76.95 270 top
K  218.55,47.1 0 top
L  237.6,47.1 0 top
L_ALT  104.25,9 0 top
L_CTRL  66.15,9 0 top
L_SHIFT  66.15,28.05 0 top
L_SPACE  132.82,9 180 top
L_SPACE1  113.77,8.93 180 top
L_SPACE2  170.97,9 180 top
L_WIN  85.2,9 0 top
LEFT  275.7,9 0 top
LEFT_BRACKET  275.7,66.15 0 top
LEFT_CBRACE  332.85,104.25 0 top
LEFT_PAREN  237.6,104.25 0 top
LESS_THAN  218.55,28.05 0 top
LL_SPACE  123.3,9 0 top
LR_SPACE  142.35,9 0 top
M  199.5,28.05 0 top
MINUS  275.7,85.2 0 top
N  180.45,28.05 0 top
NUM_1  332.85,9 0 top
NUM_2  351.9,9 0 top
NUM_3  370.95,9 0 top
NUM_4  332.85,28.05 0 top
NUM_5  351.9,28.05 0 top
NUM_6  370.95,28.05 0 top
NUM_7  332.85,47.1 0 top
NUM_8  351.9,47.1 0 top
NUM_9  370.95,47.1 0 top
NUMPAD_0_BOTTOM  313.8,28.05 0 top
NUMPAD_0_FULL  313.8,37.57 90 top
NUMPAD_0_TOP  313.8,47.1 0 top
O  237.6,66.15 0 top
P  256.65,66.15 0 top
PASTE  47.1,9 0 top
PAUSE_BREAK  47.1,28.05 0 top
PERCENT  161.4,104.25 0 top
PERIOD  237.6,9 0 top
PG_DOWN  370.95,66.15 0 top
PG_UP  370.95,85.2 0 top
PIPE  370.95,104.25 0 top
PLUS  294.75,104.25 0 top
PRINT_SCREEN  9,28.05 0 top
Q  85.2,66.15 0 top
QUESTION_MARK  256.65,28.05 0 top
R  142.35,66.15 0 top
R_SHIFT  275.7,28.05 0 top
R_SPACE  189.97,9 180 top
RIGHT  313.8,9 0 top
RIGHT_BRACKET  294.75,66.15 0 top
RIGHT_CBRACE  351.9,104.25 0 top
RIGHT_PAREN  256.65,104.25 0 top
RL_SPACE  180.45,9 0 top
RR_SPACE  199.5,9 0 top
S  104.25,47.05 0 top
SCROLL_LOCK  28.05,28.05 0 top
SEMICOLON  332.85,66.15 0 top
SINGLE_QUOTE  275.7,47.1 0 top
T  161.4,66.15 0 top
TAB  66.15,66.15 0 top
TILDE  66.15,104.25 0 top
U  199.5,66.15 0 top
U$1  35.45,102.45 270 top
U$2  20.45,102.45 270 top
UNDESCORE  275.7,104.25 0 top
UP  294.75,28.05 0 top
V  142.35,28.05 0 top
W  104.25,66.15 0 top
X  104.25,28.1 0 top
Y  180.45,66.15 0 top
Z  85.2,28.05 0 top

### Tracks (layer width: path | path; a pad name or v marks a point on that pad's centre or on a via)
C0
  Top 0.152: F4.MX2 11.54,105.36 11.58,105.32 11.58,103.18 11.54,103.13 F3.MX2 | F3.MX2 11.54,85.95 | F3.MX2 11.54,86.31 11.58,86.27 11.58,84.13 11.54,84.08 F2.MX2 11.54,67.26 11.58,67.22 11.58,65.08 11.54,65.03 F1.MX2 11.54,48.21 11.58,48.17 11.58,46.03 11.54,45.98 PRINT_SCREEN.MX2 11.54,29.16 11.58,29.12 11.58,26.98 11.54,26.93 CUT.MX2
  Bottom 0.152: F3.MX2 11.54,91.02 arc-90 14.08,93.56 U$2.8
C1
  Top 0.152: F6.MX2 30.59,84.08 30.63,84.13 30.63,86.27 30.59,86.31 F7.MX2 arc45 30.57,90.33 25.95,94.95 arc-45 25.51,96.01 F8.MX2 | F6.MX2 30.59,67.26 30.63,67.22 30.63,65.08 30.59,65.03 F5.MX2 30.59,48.21 30.63,48.17 30.63,46.03 30.59,45.98 SCROLL_LOCK.MX2 30.59,29.16 30.63,29.12 30.63,26.98 30.59,26.93 COPY.MX2 | F6.MX2 23.23,71.23 arc90 21.95,69.95 21.95,69.56 arc-90 J1.10
C2
  Top 0.152: F12.MX2 49.64,105.36 49.68,105.32 49.68,103.18 49.64,103.13 49.64,93.45 | 49.64,93.45 F11.MX2 49.64,86.31 49.68,86.27 49.68,84.13 49.64,84.08 F10.MX2 49.64,67.26 49.68,67.22 49.68,65.08 49.64,65.03 F9.MX2 49.64,48.21 49.68,48.17 49.68,46.03 49.64,45.98 PAUSE_BREAK.MX2 49.64,29.16 49.68,29.12 49.68,26.98 49.64,26.93 PASTE.MX2 | U$1.8 49.53,93.56 49.64,93.45
C3
  Top 0.152: TILDE.MX2 68.69,105.36 68.73,105.32 68.73,103.18 68.69,103.13 ESCAPE.MX2 68.69,86.31 68.73,86.27 68.73,84.13 68.69,84.08 TAB.MX2 68.69,67.26 68.73,67.22 68.73,65.08 68.69,65.03 CAPS_LOCK.MX2 68.69,48.21 68.73,48.17 68.73,46.03 68.69,45.98 L_SHIFT.MX2 68.69,29.16 68.73,29.12 68.73,26.98 68.69,26.93 L_CTRL.MX2
  Bottom 0.152: ESCAPE.MX2 68.69,94.08 arc90 66.15,96.62 35.97,96.62 arc90 U$1.7
C4
  Top 0.152: EXCLAMATION.MX2 87.74,105.36 87.78,105.32 87.78,103.18 87.74,103.13 1.MX2 87.74,86.31 87.78,86.27 87.78,84.13 87.74,84.08 Q.MX2 87.74,67.26 87.78,67.22 87.78,65.08 | 87.74,65.03 87.78,65.08 | L_WIN.MX2 87.74,26.93 87.78,26.98 87.78,29.12 87.74,29.16 Z.MX2 87.74,45.98 87.78,46.03 87.78,48.17 87.74,48.21 87.74,51.95 | 87.74,51.95 A.MX2 | 87.78,65.08 87.78,51.99 87.74,51.95
  Bottom 0.152: 1.MX2 87.74,94.41 arc90 85.2,96.95 39.95,96.95 arc-90 38.95,97.95 arc90 38.26,98.64 U$1.6
C5
  Top 0.152: AT.MX2 106.79,105.36 106.83,105.32 106.83,103.18 106.79,103.13 2.MX2 106.79,86.31 106.83,86.27 106.83,84.13 106.79,84.08 W.MX2 106.79,67.26 106.83,67.22 106.83,65.08 106.79,65.03 S.MX2 106.79,48.16 106.83,48.12 106.83,45.98 106.79,45.93 X.MX2 106.79,29.21 106.83,29.17 106.83,27.03 106.79,26.98 L_ALT.MX2 106.92,13.95 106.92,6.39 arc90 109.46,3.85 L_SPACE1.MX2
  Bottom 0.152: AT.MX2 arc90 104.52,111.6 39.91,111.6 arc90 38.25,109.94 38.25,103.72 arc-90 35.71,101.18 U$1.5
C6
  Top 0.152: HASH.MX2 125.84,105.36 125.88,105.32 125.88,103.18 125.84,103.13 3.MX2 125.84,86.31 125.88,86.27 125.88,84.13 125.84,84.08 E.MX2 125.84,67.26 125.88,67.22 125.88,65.08 125.85,65.05 125.85,52.19 D.MX2 125.84,48.21 125.88,48.17 125.88,46.03 125.84,45.98 C.MX2 125.84,29.16 125.88,29.12 125.88,22.07 arc45 126.63,20.27 128.24,18.66 arc-45 128.95,16.95 128.95,16.62 arc-90 126.41,14.08 LL_SPACE.MX2 arc-45 125.95,13.81 125.95,7.2 arc45 126.69,5.4 127.43,4.66 arc45 129.23,3.92 L_SPACE.MX2
  Bottom 0.152: HASH.MX2 125.84,109.41 arc90 123.3,111.95 39.95,111.95 arc90 37.89,109.89 37.89,106.16 arc-90 U$1.4
C7
  Top 0.152: DOLLAR.MX2 144.89,105.36 144.93,105.32 144.93,103.18 144.89,103.13 4.MX2 144.89,86.31 144.93,86.27 144.93,84.13 144.89,84.08 R.MX2 144.89,67.26 144.93,67.22 144.93,65.08 144.89,65.03 F.MX2 144.89,48.21 144.93,48.17 144.93,46.03 144.89,45.98 V.MX2 144.89,29.16 144.93,29.12 144.93,24.98 arc45 145.68,23.18 147.21,21.66 arc-45 147.95,19.86 147.95,16.62 arc-90 145.41,14.08 LR_SPACE.MX2
  Bottom 0.152: DOLLAR.MX2 144.89,109.77 arc90 142.35,112.31 39.87,112.31 arc90 37.56,110 37.56,108.37 arc-90 U$1.3
C8
  Top 0.152: PERCENT.MX2 163.94,105.36 163.98,105.32 163.98,103.18 163.94,103.13 5.MX2 163.94,86.31 163.98,86.27 163.98,84.13 163.94,84.08 T.MX2 163.94,67.26 163.98,67.22 163.98,65.08 163.94,65.03 G.MX2 163.94,48.21 163.98,48.17 163.98,46.03 163.94,45.98 B.MX2 163.94,29.16 163.98,29.12 163.98,26.98 163.94,26.93 FN.MX2 164.01,14.01 164.01,6.34 arc90 166.43,3.92 L_SPACE2.MX2
  Bottom 0.152: PERCENT.MX2 163.94,110.11 arc90 161.4,112.65 39.77,112.65 arc90 37.23,110.11 37.23,109.91 arc-90 36.12,108.8 U$1.2
C9
  Top 0.152: CARROT.MX2 182.99,105.36 183.03,105.32 183.03,103.18 182.99,103.13 6.MX2 182.99,86.31 183.03,86.27 183.03,84.13 182.99,84.08 Y.MX2 182.99,67.26 183.03,67.22 183.03,65.08 182.99,65.03 H.MX2 182.99,48.21 183.03,48.17 183.03,46.03 182.99,45.98 N.MX2 182.99,29.16 183.03,29.12 183.03,26.98 182.99,26.93 182.99,21.96 arc45 183.73,20.16 185.24,18.66 arc-45 185.95,16.95 185.95,16.62 arc-90 183.41,14.08 RL_SPACE.MX2 182.99,13.37 arc90 183.15,13.2 arc-90 183.2,13.16 183.2,6.46 arc90 185.74,3.92 R_SPACE.MX2
  Bottom 0.152: 6.MX2 arc90 181.16,92.11 91.05,92.11 arc90 89.87,90.93 89.87,89.81 arc-90 88.73,88.68 87.55,88.68 arc-45 85.75,89.42 85.75,89.43 arc45 84.48,89.95 73,89.95 arc45 71.21,89.2 70.95,88.95 arc-45 68.83,88.07 arc-90 67.18,89.72 67.18,93.48 arc90 64.35,96.3 38.26,96.3 arc90 36.85,94.9 36.85,92.32 arc-90 J2.1
C10
  Top 0.152: AMPERSAND.MX2 202.04,105.36 202.08,105.32 202.08,103.18 202.04,103.13 7.MX2 202.04,86.31 202.08,86.27 202.08,84.13 202.04,84.08 U.MX2 202.04,67.26 202.08,67.22 202.08,65.08 202.04,65.03 J.MX2 202.04,48.21 202.08,48.17 202.08,46.03 202.04,45.98 M.MX2 202.04,29.16 202.08,29.12 202.08,23.92 arc45 202.83,22.13 204.21,20.75 arc-45 204.95,18.95 204.95,16.62 arc-90 202.41,14.08 RR_SPACE.MX2
  Bottom 0.152: 7.MX2 185.66,90.28 arc90 184.94,89.55 arc-90 183.3,87.92 183.08,87.92 arc-90 181.31,89.69 181.31,89.96 arc90 179.49,91.78 91.08,91.78 arc90 90.18,90.88 90.18,89.78 arc-90 88.75,88.35 87.42,88.35 arc-45 85.63,89.09 85.59,89.13 arc45 84.36,89.64 73.02,89.64 arc45 71.53,89.02 71.28,88.77 arc-45 68.85,87.77 68.8,87.77 arc-90 66.87,89.7 66.87,93.48 arc90 64.35,96 38.41,96 arc90 37.16,94.75 37.16,90.09 arc-90 J2.2
C11  (via drill 0.35)
  Top 0.152: ASTERICK.MX2 221.09,105.36 221.13,105.32 221.13,103.18 221.09,103.13 8.MX2 221.09,86.31 221.13,86.27 221.13,84.13 221.09,84.08 I.MX2 221.09,67.26 221.13,67.22 221.13,65.08 221.09,65.03 K.MX2 221.09,48.21 221.13,48.17 221.13,46.03 221.09,45.98 LESS_THAN.MX2 221.09,29.16 221.13,29.12 221.13,26.98 221.09,26.93 COMMA.MX2 | v32.95,75.95 32.95,78.26 arc-90 J2.5
  Bottom 0.152: I.MX2 221.09,72.73 arc90 218.55,75.27 39.13,75.27 arc90 38.62,74.76 38.62,63.49 arc-90 36.08,60.95 33.94,60.95 arc-90 31.4,63.49 31.4,67.63 arc-45 31.95,68.95 32.21,69.2 arc45 32.95,71 v32.95,75.95
C12
  Top 0.152: LEFT_PAREN.MX2 240.14,105.36 240.18,105.32 240.18,103.18 240.14,103.13 9.MX2 240.14,86.31 240.18,86.27 240.18,84.13 240.14,84.08 O.MX2 240.14,67.26 240.18,67.22 240.18,65.08 240.14,65.03 L.MX2 240.14,48.21 240.18,48.17 240.18,46.03 240.14,45.98 GREATER_THAN.MX2 240.14,29.16 240.18,29.12 240.18,26.98 240.14,26.93 PERIOD.MX2
  Bottom 0.152: O.MX2 240.14,73.07 arc90 237.6,75.61 39.03,75.61 arc90 38.29,74.87 38.29,64.86 arc-90 36.41,62.98 J2.12
C13
  Top 0.152: RIGHT_PAREN.MX2 259.19,105.36 259.23,105.32 259.23,103.18 259.19,103.13 0.MX2 259.19,86.31 259.23,86.27 259.23,84.13 259.19,84.08 P.MX2 259.19,67.26 259.23,67.22 259.23,65.08 259.19,65.03 COLON.MX2 259.19,48.21 259.23,48.17 259.23,46.03 259.19,45.98 QUESTION_MARK.MX2 259.19,29.16 259.23,29.12 259.23,26.98 259.19,26.93 FRONT_SLASH.MX2
  Bottom 0.152: P.MX2 259.19,73.41 arc90 256.65,75.95 39.03,75.95 arc90 37.95,74.87 37.95,68.02 arc-90 J2.11
C14
  Top 0.152: UNDESCORE.MX2 278.24,105.36 278.28,105.32 278.28,103.18 278.24,103.13 MINUS.MX2 278.24,86.31 278.28,86.27 278.28,84.13 278.24,84.08 LEFT_BRACKET.MX2 278.24,67.26 278.28,67.22 278.28,65.08 278.24,65.03 SINGLE_QUOTE.MX2 278.24,48.21 278.28,48.17 278.28,46.03 278.24,45.98 R_SHIFT.MX2 278.24,29.16 278.28,29.12 278.28,26.98 278.24,26.93 LEFT.MX2
  Bottom 0.152: LEFT_BRACKET.MX2 278.24,73.74 arc90 275.7,76.28 39.06,76.28 arc90 37.62,74.83 37.62,69.26 arc-90 36.41,68.06 J2.10
C15
  Top 0.152: PLUS.MX2 297.29,105.36 297.33,105.32 297.33,103.18 297.29,103.13 EQUALS.MX2 297.29,86.31 297.33,86.27 297.33,84.13 297.29,84.08 RIGHT_BRACKET.MX2 297.29,67.26 297.33,67.22 297.33,65.08 297.29,65.03 ENTER.MX2 297.29,48.21 297.33,48.17 297.33,46.03 297.29,45.98 UP.MX2 297.29,29.16 297.33,29.12 297.33,26.98 297.29,26.93 DOWN.MX2
  Bottom 0.152: RIGHT_BRACKET.MX2 297.29,74.08 arc90 294.75,76.62 39.04,76.62 arc90 37.3,74.88 37.3,72.45 arc-90 J2.9
C16
  Top 0.152: DELETE.MX2 316.34,105.36 316.38,105.32 316.38,103.18 316.34,103.13 BACKSPACE.MX2 316.34,86.31 316.38,86.27 316.38,84.13 316.34,84.08 BACK_SLASH.MX2 316.34,67.26 316.38,67.22 316.38,65.08 316.34,65.03 NUMPAD_0_TOP.MX2 316.34,51.34 arc-90 314.95,49.95 313.49,49.95 arc90 310.95,47.41 310.95,42.34 arc-90 NUMPAD_0_FULL.MX2 308.72,37.18 arc90 309.95,35.95 310.95,35.95 arc-45 312.39,35.35 313.32,34.42 arc45 314.16,34.07 314.34,34.07 arc-45 316.14,33.33 NUMPAD_0_BOTTOM.MX2 316.34,29.16 316.38,29.12 316.38,26.98 316.34,26.93 RIGHT.MX2
  Bottom 0.152: BACK_SLASH.MX2 316.34,74.41 arc90 313.8,76.95 39.07,76.95 arc90 36.95,74.83 36.95,74.64 arc-90 J2.8
C17
  Top 0.152: LEFT_CBRACE.MX2 335.39,105.36 335.43,105.32 335.43,103.18 335.39,103.13 HOME.MX2 335.39,86.31 335.43,86.27 335.43,84.13 335.39,84.08 SEMICOLON.MX2 335.39,67.26 335.43,67.22 335.43,65.08 335.39,65.03 NUM_7.MX2 335.39,48.21 335.43,48.17 335.43,46.03 335.39,45.98 NUM_4.MX2 335.39,29.16 335.43,29.12 335.43,26.98 335.39,26.93 NUM_1.MX2
  Bottom 0.152: SEMICOLON.MX2 335.39,74.74 arc90 332.85,77.28 37.05,77.28 arc90 J2.7
C18
  Top 0.152: RIGHT_CBRACE.MX2 354.44,105.36 354.48,105.32 354.48,103.18 354.44,103.13 END.MX2 354.44,86.31 354.48,86.27 354.48,84.13 354.44,84.08 DBL_QUOTE.MX2 354.44,67.26 354.48,67.22 354.48,65.08 354.44,65.03 NUM_8.MX2 354.44,48.21 354.48,48.17 354.48,46.03 354.44,45.98 NUM_5.MX2 354.44,29.16 354.48,29.12 354.48,26.98 354.44,26.93 NUM_2.MX2
  Bottom 0.152: DBL_QUOTE.MX2 354.44,75.09 arc90 351.9,77.63 36.04,77.63 arc-90 J2.6
C19  (via drill 0.35)
  Top 0.152: PIPE.MX2 373.49,105.36 373.53,105.32 373.53,103.18 373.49,103.13 PG_UP.MX2 373.49,86.31 373.53,86.27 373.53,71.86 373.95,71.45 373.73,71.23 PG_DOWN.MX2 373.49,67.26 373.53,67.22 373.53,65.08 373.49,65.03 NUM_9.MX2 373.49,48.21 373.53,48.17 373.53,46.03 373.49,45.98 NUM_6.MX2 373.49,29.16 373.53,29.12 373.53,26.98 373.49,26.93 NUM_3.MX2 | v37.53,78.53 37.53,78.09 arc-90 36.4,76.96 34.91,76.96 arc90 33.92,75.98 arc-90 32.89,74.95 v31.95,74.95
  Bottom 0.152: PG_DOWN.MX2 373.49,75.41 arc90 370.95,77.95 38.12,77.95 arc-90 v37.53,78.53 | v31.95,74.95 22.95,74.95 arc90 21.95,73.95 21.95,67.95 arc-90 20.79,66.79 20.31,66.79 arc90 18.99,65.46 18.99,64.44 arc90 J1.12
GND
  pour Bottom: -0.05,111.45 -0.05,112.45 0.45,112.95 0.95,113.45 1.45,113.45 378.95,113.45 379.45,112.95 379.95,112.45 379.95,110.95 379.95,0.95 379.45,0.45 378.95,-0.05 377.95,-0.05 0.95,-0.05 -0.05,0.95 -0.05,8.95
  pour Top: -0.05,111.45 -0.05,112.45 0.45,112.95 0.95,113.45 1.45,113.45 378.95,113.45 379.45,112.95 379.95,112.45 379.95,111.45 379.95,0.95 378.95,-0.05 376.95,-0.05 0.95,-0.05 -0.05,0.95
N$1
  Bottom 0.152: F4.MX1 4.4,106.79 arc90 1.86,104.25 D1.A
N$2
  Bottom 0.152: D2.A 31.9,101.67 F8.MX1
N$3
  Bottom 0.152: F12.MX1 44.08,106 D3.A
N$4
  Bottom 0.152: TILDE.MX1 59.17,106.79 arc90 56.62,104.25 D4.A
N$5
  Bottom 0.152: EXCLAMATION.MX1 78.22,106.79 arc90 75.67,104.25 D5.A
N$6
  Bottom 0.152: AT.MX1 97.27,106.79 arc90 94.73,104.25 D6.A
N$7
  Bottom 0.152: HASH.MX1 116.31,106.79 arc90 113.78,104.25 D7.A
N$8
  Bottom 0.152: DOLLAR.MX1 135.36,106.79 arc90 132.82,104.25 D8.A
N$9
  Bottom 0.152: PERCENT.MX1 154.41,106.79 arc90 151.88,104.25 D9.A
N$10
  Bottom 0.152: CARROT.MX1 173.46,106.79 arc90 170.92,104.25 D10.A
N$11
  Bottom 0.152: AMPERSAND.MX1 192.51,106.79 arc90 189.97,104.25 D11.A
N$12
  Bottom 0.152: ASTERICK.MX1 211.56,106.79 arc90 209.02,104.25 D12.A
N$13
  Bottom 0.152: LEFT_PAREN.MX1 230.61,106.79 arc90 228.07,104.25 D13.A
N$14
  Bottom 0.152: RIGHT_PAREN.MX1 249.66,106.79 arc90 247.12,104.25 D14.A
N$15
  Bottom 0.152: UNDESCORE.MX1 268.71,106.79 arc90 266.18,104.25 D15.A
N$16
  Bottom 0.152: PLUS.MX1 287.76,106.79 arc90 285.22,104.25 D16.A
N$17
  Bottom 0.152: DELETE.MX1 306.81,106.79 arc90 304.27,104.25 D17.A
N$18
  Bottom 0.152: LEFT_CBRACE.MX1 325.87,106.79 arc90 323.32,104.25 D18.A
N$19
  Bottom 0.152: RIGHT_CBRACE.MX1 344.91,106.79 arc90 342.38,104.25 D19.A
N$20
  Bottom 0.152: PIPE.MX1 363.96,106.79 arc90 361.43,104.25 D20.A
N$21
  Bottom 0.152: F3.MX1 4.4,87.74 arc90 1.86,85.2 D21.A
N$22
  Bottom 0.152: F7.MX1 25.12,86.86 D22.A
N$23
  Bottom 0.152: F11.MX1 41.61,87.74 arc90 39.08,85.2 D23.A
N$24
  Bottom 0.152: ESCAPE.MX1 59.17,87.74 arc90 56.62,85.2 D24.A
N$25
  Bottom 0.152: 1.MX1 78.22,87.74 arc90 75.67,85.2 D25.A
N$26
  Bottom 0.152: 2.MX1 97.27,87.74 arc90 94.73,85.2 D26.A
N$27
  Bottom 0.152: 3.MX1 116.31,87.74 arc90 113.78,85.2 D27.A
N$28
  Bottom 0.152: 4.MX1 135.36,87.74 arc90 132.82,85.2 D28.A
N$29
  Bottom 0.152: 5.MX1 154.41,87.74 arc90 151.88,85.2 D29.A
N$30
  Bottom 0.152: 6.MX1 173.46,87.74 arc90 170.92,85.2 D30.A
N$31
  Bottom 0.152: 7.MX1 192.51,87.74 arc90 189.97,85.2 D31.A
N$32
  Bottom 0.152: 8.MX1 211.56,87.74 arc90 209.02,85.2 D32.A
N$33
  Bottom 0.152: 9.MX1 230.61,87.74 arc90 228.07,85.2 D33.A
N$34
  Bottom 0.152: 0.MX1 249.66,87.74 arc90 247.12,85.2 D34.A
N$35
  Bottom 0.152: MINUS.MX1 268.71,87.74 arc90 266.18,85.2 D35.A
N$36
  Bottom 0.152: EQUALS.MX1 287.76,87.74 arc90 285.22,85.2 D36.A
N$37
  Bottom 0.152: BACKSPACE.MX1 306.81,87.74 arc90 304.27,85.2 D37.A
N$38
  Bottom 0.152: HOME.MX1 325.87,87.74 arc90 323.32,85.2 D38.A
N$39
  Bottom 0.152: END.MX1 344.91,87.74 arc90 342.38,85.2 D39.A
N$40
  Bottom 0.152: PG_UP.MX1 363.96,87.74 arc90 361.43,85.2 D40.A
N$41
  Bottom 0.152: F2.MX1 4.4,68.69 arc90 1.86,66.15 D41.A
N$42
  Bottom 0.152: F6.MX1 25.03,67.9 D42.A
N$43
  Bottom 0.152: F10.MX1 42.74,68.69 arc45 40.95,67.95 arc45 40.44,66.71 D43.A
N$44
  Bottom 0.152: TAB.MX1 59.17,68.69 arc90 56.62,66.15 D44.A
N$45
  Bottom 0.152: Q.MX1 78.22,68.69 arc90 75.67,66.15 D45.A
N$46
  Bottom 0.152: W.MX1 97.27,68.69 arc90 94.73,66.15 D46.A
N$47
  Bottom 0.152: E.MX1 116.31,68.69 arc90 113.78,66.15 D47.A
N$48
  Bottom 0.152: R.MX1 135.36,68.69 arc90 132.82,66.15 D48.A
N$49
  Bottom 0.152: T.MX1 154.41,68.69 arc90 151.88,66.15 D49.A
N$50
  Bottom 0.152: Y.MX1 173.46,68.69 arc90 170.92,66.15 D50.A
N$51
  Bottom 0.152: U.MX1 192.51,68.69 arc90 189.97,66.15 D51.A
N$52
  Bottom 0.152: I.MX1 211.56,68.69 arc90 209.02,66.15 D52.A
N$53
  Bottom 0.152: O.MX1 230.61,68.69 arc90 228.07,66.15 D53.A
N$54
  Bottom 0.152: P.MX1 249.66,68.69 arc90 247.12,66.15 D54.A
N$55
  Bottom 0.152: LEFT_BRACKET.MX1 268.71,68.69 arc90 266.18,66.15 D55.A
N$56
  Bottom 0.152: RIGHT_BRACKET.MX1 287.76,68.69 arc90 285.22,66.15 D56.A
N$57
  Bottom 0.152: BACK_SLASH.MX1 306.81,68.69 arc90 304.27,66.15 D57.A
N$58
  Bottom 0.152: SEMICOLON.MX1 325.87,68.69 arc90 323.32,66.15 D58.A
N$59
  Bottom 0.152: DBL_QUOTE.MX1 344.91,68.69 arc90 342.38,66.15 D59.A
N$60
  Bottom 0.152: PG_DOWN.MX1 363.96,68.69 arc90 361.43,66.15 D60.A
N$61
  Bottom 0.152: F1.MX1 4.4,49.64 arc90 1.86,47.1 D61.A
N$62
  Bottom 0.152: F5.MX1 21.06,49.64 arc90 18.52,47.1 D62.A
N$63
  Bottom 0.152: F9.MX1 40.11,49.64 arc90 37.58,47.1 D63.A
N$64
  Bottom 0.152: CAPS_LOCK.MX1 59.17,49.64 arc90 56.62,47.1 D64.A
N$65
  Bottom 0.152: A.MX1 78.22,49.64 arc90 75.67,47.1 D65.A
N$66
  Bottom 0.152: S.MX1 97.27,49.59 arc90 94.73,47.05 D66.A
N$67
  Bottom 0.152: D.MX1 116.31,49.64 arc90 113.78,47.1 D67.A
N$68
  Bottom 0.152: F.MX1 135.36,49.64 arc90 132.82,47.1 D68.A
N$69
  Bottom 0.152: G.MX1 154.41,49.64 arc90 151.88,47.1 D69.A
N$70
  Bottom 0.152: H.MX1 173.46,49.64 arc90 170.92,47.1 D70.A
N$71
  Bottom 0.152: J.MX1 192.51,49.64 arc90 189.97,47.1 D71.A
N$72
  Bottom 0.152: K.MX1 211.56,49.64 arc90 209.02,47.1 D72.A
N$73
  Bottom 0.152: L.MX1 230.61,49.64 arc90 228.07,47.1 D73.A
N$74
  Bottom 0.152: COLON.MX1 249.66,49.64 arc90 247.12,47.1 D74.A
N$75
  Bottom 0.152: SINGLE_QUOTE.MX1 268.71,49.64 arc90 266.18,47.1 D75.A
N$76
  Bottom 0.152: ENTER.MX1 287.76,49.64 arc90 285.22,47.1 D76.A
N$77
  Top 0.152: NUMPAD_0_FULL.MX1 310.16,34.86 arc45 309.95,34.95 arc-45 308.24,35.66 307.42,36.48 arc-45 306.68,38.28 306.68,39.93 arc-45 307.42,41.73 309.53,43.84 arc45 310.27,45.64 310.27,48.95 arc45 NUMPAD_0_TOP.MX1
  Bottom 0.152: NUMPAD_0_TOP.MX1 309.99,50.91 arc90 308.95,51.95 306.81,51.95 arc90 304.27,49.41 D77.A
N$79
  Bottom 0.152: NUM_8.MX1 344.91,49.64 arc90 342.38,47.1 D79.A
N$80
  Bottom 0.152: NUM_9.MX1 363.96,49.64 arc90 361.43,47.1 D80.A
N$81
  Bottom 0.152: PRINT_SCREEN.MX1 4.4,30.59 arc90 1.86,28.05 D81.A
N$82
  Bottom 0.152: SCROLL_LOCK.MX1 21.06,30.59 arc90 18.52,28.05 D82.A
N$83
  Bottom 0.152: PAUSE_BREAK.MX1 40.11,30.59 arc90 37.58,28.05 D83.A
N$84
  Bottom 0.152: L_SHIFT.MX1 59.17,30.59 arc90 56.62,28.05 D84.A
N$85
  Bottom 0.152: Z.MX1 78.22,30.59 arc90 75.67,28.05 D85.A
N$86
  Bottom 0.152: X.MX1 97.27,30.64 arc90 94.73,28.1 D86.A
N$87
  Bottom 0.152: C.MX1 116.31,30.59 arc90 113.78,28.05 D87.A
N$88
  Bottom 0.152: V.MX1 135.36,30.59 arc90 132.82,28.05 D88.A
N$89
  Bottom 0.152: B.MX1 154.41,30.59 arc90 151.88,28.05 D89.A
N$90
  Bottom 0.152: N.MX1 173.46,30.59 arc90 170.92,28.05 D90.A
N$91
  Bottom 0.152: M.MX1 192.51,30.59 arc90 189.97,28.05 D91.A
N$92
  Bottom 0.152: LESS_THAN.MX1 211.56,30.59 arc90 209.02,28.05 D92.A
N$93
  Bottom 0.152: GREATER_THAN.MX1 230.61,30.59 arc90 228.07,28.05 D93.A
N$94
  Bottom 0.152: QUESTION_MARK.MX1 249.66,30.59 arc90 247.12,28.05 D94.A
N$95
  Bottom 0.152: R_SHIFT.MX1 268.71,30.59 arc90 266.18,28.05 D95.A
N$96
  Bottom 0.152: UP.MX1 287.76,30.59 arc90 285.22,28.05 D96.A
N$97
  Bottom 0.152: NUMPAD_0_BOTTOM.MX1 304.43,30.59 arc90 301.89,28.05 D97.A
N$98
  Bottom 0.152: NUM_4.MX1 329.43,30.19 arc-45 329.95,28.95 329.95,26.17 arc45 D98.A
N$99
  Bottom 0.152: NUM_5.MX1 344.91,30.59 arc90 342.38,28.05 D99.A
N$100
  Bottom 0.152: NUM_6.MX1 363.96,30.59 arc90 361.43,28.05 D100.A
N$101
  Bottom 0.152: CUT.MX1 4.4,11.54 arc90 1.86,9 D101.A
N$102
  Bottom 0.152: COPY.MX1 21.06,11.54 arc90 18.52,9 D102.A
N$103
  Bottom 0.152: PASTE.MX1 40.11,11.54 arc90 37.58,9 D103.A
N$104
  Bottom 0.152: L_CTRL.MX1 59.17,11.54 arc90 56.62,9 D104.A
N$105
  Bottom 0.152: L_WIN.MX1 78.22,11.54 arc90 75.67,9 D105.A
N$106
  Bottom 0.152: D106.A 96.22,10.49 arc-90 97.27,11.54 L_ALT.MX1 arc-90 100.95,11.03 100.95,8.93 arc90 103.57,6.31 117.5,6.31 L_SPACE1.MX1
N$107
  Bottom 0.152: L_SPACE.MX1 136.42,6.68 arc-45 135.67,8.47 135.67,9.21 arc45 134.95,10.95 134.69,11.2 arc45 132.9,11.95 120.48,11.95 arc45 LL_SPACE.MX1 105.94,11.54 arc-45 104.95,11.95 103.69,13.2 arc45 101.9,13.95 95.66,13.95 arc90 93.12,11.41 D107.A
N$108
  Bottom 0.152: LR_SPACE.MX1 138.84,11.24 arc-45 139.59,9.44 139.59,6.8 arc45 D108.A
N$109
  Bottom 0.152: D109.A 153.48,10.61 arc-90 154.41,11.54 FN.MX1 arc-90 157.95,11.18 157.95,9 arc90 160.98,5.97 174.29,5.97 L_SPACE2.MX1
N$110
  Bottom 0.152: R_SPACE.MX1 193.36,6.88 arc-45 192.62,8.68 192.62,9.33 arc45 191.95,10.95 191.69,11.2 arc45 189.9,11.95 177.63,11.95 arc45 RL_SPACE.MX1 173.95,11.54 173.46,11.54 162.94,11.54 arc-45 161.95,11.95 161.42,12.48 arc45 159.62,13.22 152.95,13.22 arc90 150.41,10.68 D110.A
N$111
  Bottom 0.152: RR_SPACE.MX1 195.88,11.35 arc-45 196.63,9.55 196.63,7.06 arc45 D111.A
N$112
  Bottom 0.152: COMMA.MX1 211.56,11.54 arc90 209.02,9 D112.A
N$113
  Bottom 0.152: PERIOD.MX1 230.61,11.54 arc90 228.07,9 D113.A
N$114
  Bottom 0.152: FRONT_SLASH.MX1 249.66,11.54 arc90 247.12,9 D114.A
N$115
  Bottom 0.152: LEFT.MX1 268.71,11.54 arc90 266.18,9 D115.A
N$116
  Bottom 0.152: DOWN.MX1 287.76,11.54 arc90 285.22,9 D116.A
N$117
  Bottom 0.152: RIGHT.MX1 306.81,11.54 arc90 304.27,9 D117.A
N$118
  Bottom 0.152: NUM_1.MX1 325.87,11.54 arc90 323.32,9 D118.A
N$119
  Bottom 0.152: NUM_2.MX1 344.91,11.54 arc90 342.38,9 D119.A
N$120
  Bottom 0.152: NUM_3.MX1 363.96,11.54 arc90 361.43,9 D120.A
N$121
  Bottom 0.152: NUM_7.MX1 327.69,49.64 arc45 325.9,48.89 324.07,47.07 arc45 323.32,45.27 D78.A
R0
  Bottom 0.152: D20.C 361.04,97.47 342.76,97.47 D19.C D18.C D17.C D16.C D15.C D14.C D13.C D12.C D11.C D10.C D9.C D8.C D7.C D6.C D5.C D4.C D3.C 41.05,97.85 arc-90 39.95,98.95 arc90 38.95,99.95 34.95,99.95 arc90 33.95,98.95 33.95,95.95 arc-90 32.95,94.95 32.04,94.95 arc90 D2.C 29.95,94.81 | 29.95,94.81 4.4,94.81 arc-90 1.86,97.35 D1.C | U$2.2 22.41,108.8 arc-90 24.95,106.26 24.95,104 arc45 25.69,102.2 27.21,100.69 arc-45 27.95,98.9 27.95,96.81 arc90 29.95,94.81
R1  (via drill 0.35)
  Top 0.152: v24.95,93.95 24.95,96.01 arc45 24.21,97.8 24.03,97.99 arc-45 23.85,98.41 23.85,102.38 arc-45 24.25,103.36 arc45 24.49,103.94 24.49,104.73 arc90 22.96,106.26 U$2.3
  Bottom 0.152: D40.C D39.C D38.C D37.C D36.C D35.C D34.C D33.C D32.C D31.C D30.C D29.C D28.C D27.C D26.C D25.C D24.C D23.C 38.43,79.45 34.45,79.45 arc90 32.95,77.95 arc-90 31.95,76.95 26.95,76.95 | 26.95,76.95 D22.C 3.71,76.95 arc-90 D21.C | 26.95,76.95 26.75,77.15 arc-45 26,78.95 26,83.13 arc45 25.74,83.76 arc-45 25.46,84.44 25.46,85.88 arc-45 25.94,87.05 arc45 26.15,87.55 26.15,91.69 arc45 25.41,93.49 v24.95,93.95
R2  (via drill 0.35)
  Top 0.152: v26.95,73.95 26.95,76.4 arc45 26.58,77.3 arc-45 26,78.71 26,83.02 arc45 25.71,83.72 arc-45 25.39,84.49 25.39,85.68 arc-45 25.91,86.94 arc45 26.08,87.36 26.08,89.93 arc45 25.34,91.72 24.66,92.4 arc-45 24.02,93.94 24.02,96.23 arc45 23.53,97.42 arc-45 22.92,98.9 22.92,101.31 arc45 22.53,102.26 21.5,103.28 arc45 U$2.4
  Bottom 0.152: 26.95,59.75 D42.C D41.C | 26.95,59.75 D43.C D44.C D45.C D46.C D47.C D48.C D49.C D50.C D51.C D52.C D53.C D54.C D55.C D56.C D57.C D58.C D59.C D60.C | 26.95,59.75 arc-90 25.95,60.75 25.95,64.16 arc45 25.73,64.68 arc-45 25.44,65.38 25.44,66.81 arc-45 25.91,67.93 26.21,68.22 arc45 26.95,70.02 v26.95,73.95
R3  (via drill 0.35)
  Top 0.152: v15.95,44.95 arc90 16.48,45.48 16.48,98.64 arc-90 19.02,101.18 U$2.5
  Bottom 0.152: D61.C 16.95,40.7 | 16.95,40.7 D62.C D63.C D64.C D65.C D66.C D67.C D68.C D69.C D70.C D71.C D72.C D73.C D74.C D75.C D76.C D77.C 306.35,40.7 arc45 306.95,40.95 307.24,41.24 arc-45 308.95,41.95 arc-45 310.66,41.24 310.95,40.95 arc45 311.55,40.7 D78.C D79.C D80.C | 16.95,40.7 arc-90 15.95,41.7 v15.95,44.95
R4  (via drill 0.35)
  Top 0.152: U$2.6 19.34,98.64 arc90 16.8,96.1 16.8,27.79 arc-90 v15.95,26.95
  Bottom 0.152: D81.C 16.95,21.65 | 16.95,21.65 D82.C D83.C D84.C D85.C D86.C D87.C D88.C D89.C D90.C D91.C D92.C D93.C D94.C D95.C D96.C D97.C D98.C D99.C D100.C | v15.95,26.95 15.95,22.65 arc90 16.95,21.65
R5  (via drill 0.35)
  Top 0.152: v17.07,18.93 17.11,18.97 17.11,94.95 arc-90 18.26,96.1 U$2.7
  Bottom 0.152: D120.C D119.C D118.C D117.C D116.C D115.C D114.C D113.C D112.C 205.79,2.6 arc-45 204.95,2.95 204.42,3.48 arc45 202.62,4.22 201.54,4.22 arc45 199.75,3.48 199.61,3.34 arc-45 197.82,2.6 D111.C 189.84,2.6 arc45 189.22,2.35 arc-45 188.26,1.95 187.5,1.95 arc-45 185.71,2.69 185,3.4 arc45 183.2,4.14 176.24,4.14 arc45 174.63,3.48 173.85,2.69 arc-45 172.05,1.95 164,1.95 arc-45 162.21,2.69 161.38,3.52 arc45 159.59,4.26 158.31,4.26 arc45 156.52,3.52 155.95,2.95 arc-45 155.37,2.71 D109.C 150.53,2.71 arc45 D110.C arc45 150.3,2.71 148.11,2.71 arc-45 146.98,3.17 146.78,3.38 arc45 144.99,4.12 144.55,4.12 arc45 142.75,3.38 142.67,3.29 arc-45 141,2.6 D108.C 132.71,2.6 arc45 132.05,2.33 arc-45 131.14,1.95 130,1.95 arc-45 128.21,2.69 127.44,3.46 arc45 125.64,4.2 120.26,4.2 arc45 118.46,3.46 117.69,2.69 arc-45 115.9,1.95 107,1.95 arc-45 105.21,2.69 104.42,3.48 arc45 102.62,4.23 101.28,4.23 arc45 99.48,3.48 98.95,2.95 arc-45 98.28,2.67 D106.C arc90 96.21,2.68 D107.C arc-90 93.04,2.6 D105.C | 75.75,2.67 D105.C | D105.C D104.C D103.C D102.C | D101.C D102.C | D102.C 18.3,2.6 arc-90 16.95,3.95 16.95,18.81 arc-90 v17.07,18.93

### Text on the board
bPlace: Design by Fruitykeeb | BOP V1.1